# EAGLE schematic Cubesat_Potencia-rev1 (EAGLE 7.2.0)

## Sheet 1 of 11: Conversor 12v
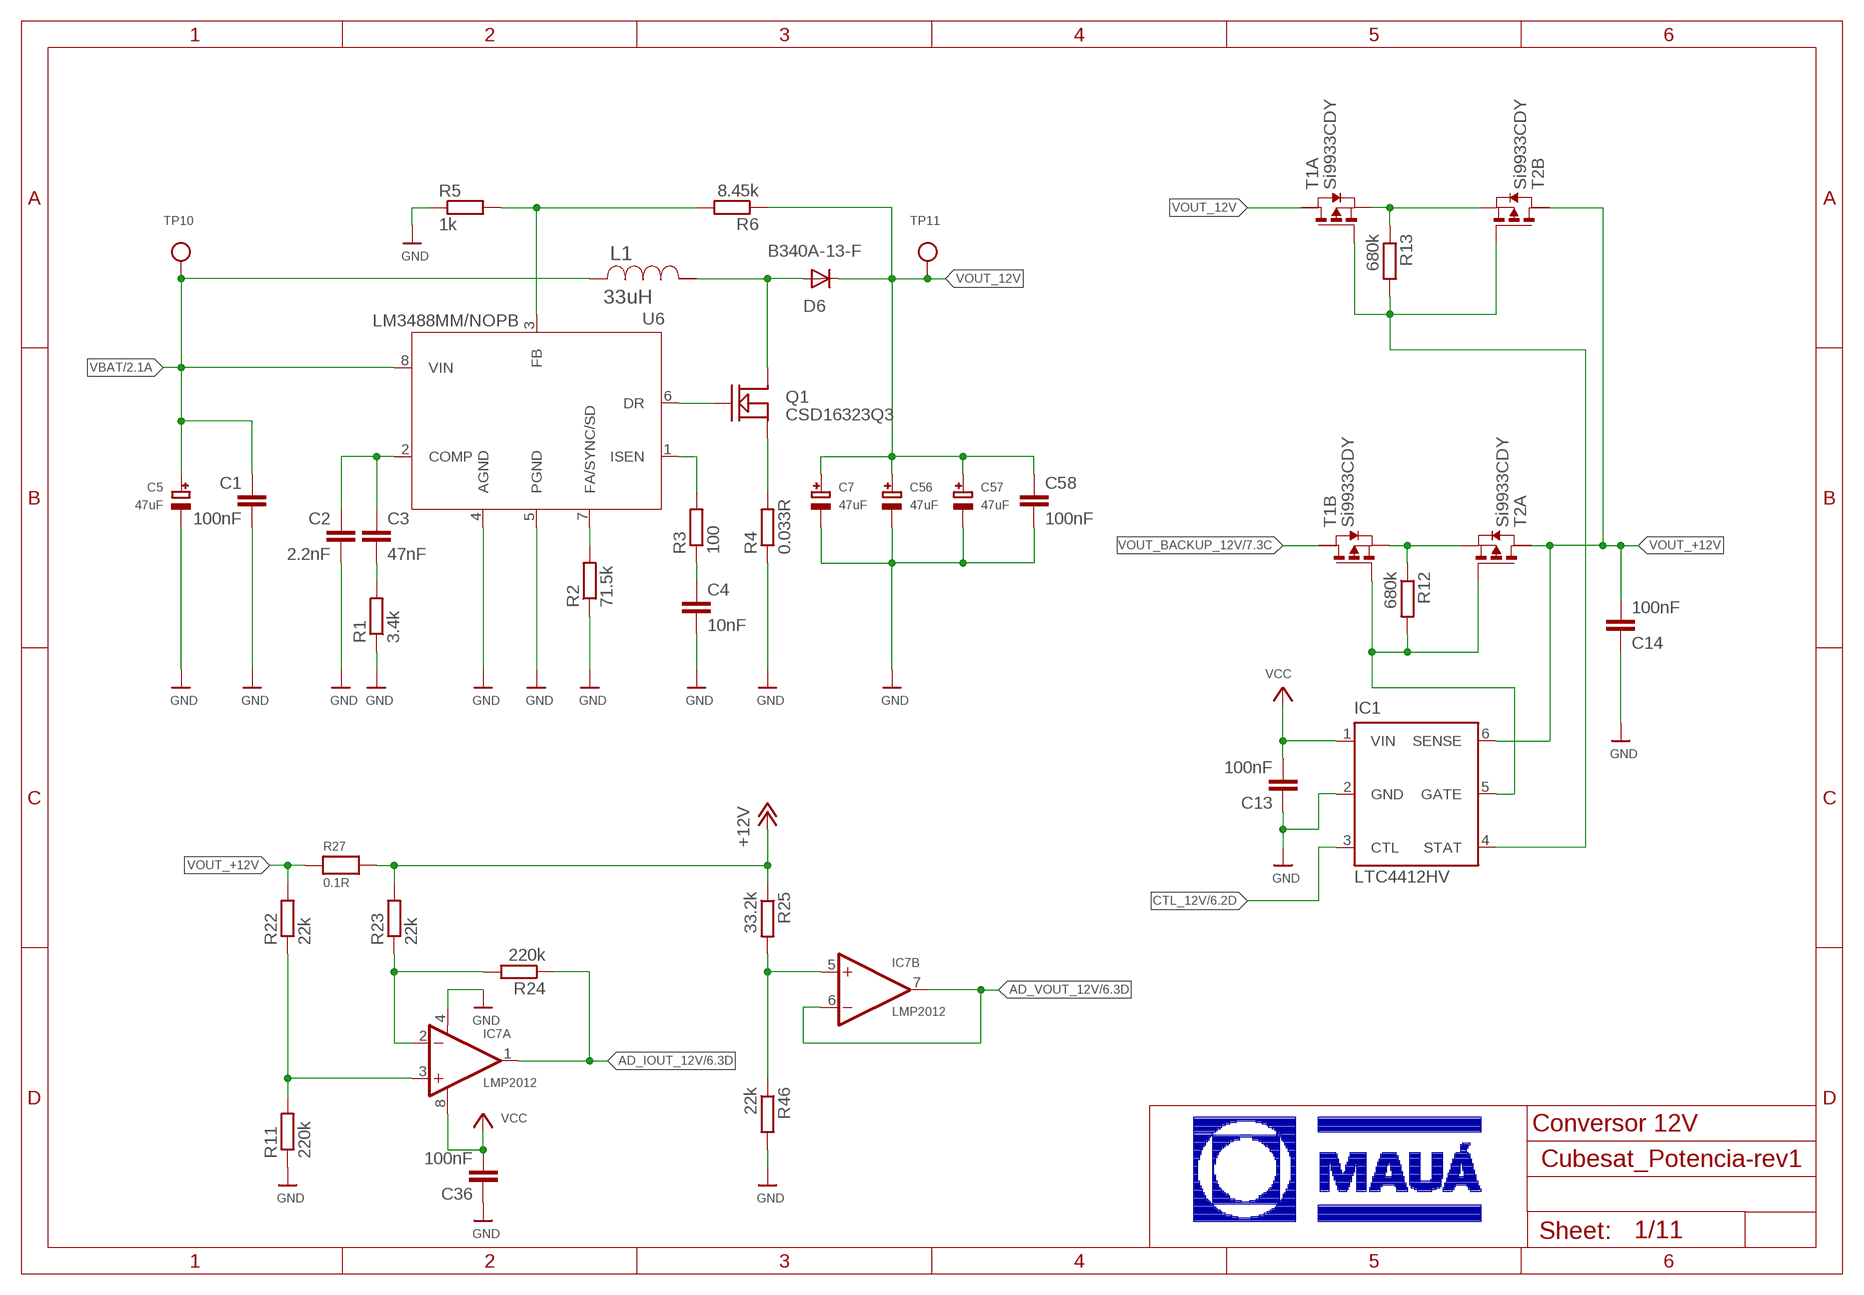
[diagram p0: schematic, sheet 1]

### Parts
C1  100nF  C-EUC0805  [C0805]
C2  2.2nF  C-EUC0805  [C0805]
C3  47nF  C-EUC0805  [C0805]
C4  10nF  C-EUC0805  [C0805]
C5  47uF  CAP_TANTALUMC/6032_REFLOW  [EIA6032-28/C-R]
C7  47uF  CAP_TANTALUMC/6032_REFLOW  [EIA6032-28/C-R]
C13  100nF  C-EUC0805  [C0805]
C14  100nF  C-EUC0805  [C0805]
C36  100nF  C-EUC0805  [C0805]
C56  47uF  CAP_TANTALUMC/6032_REFLOW  [EIA6032-28/C-R]
C57  47uF  CAP_TANTALUMC/6032_REFLOW  [EIA6032-28/C-R]
C58  100nF  C-EUC0805  [C0805]
D6  B340A-13-F  DIODE-DO214AC  [DO214AC]
IC1  LTC4412HV  [TSOT23-6]
IC7  LMP2012  OPA2237E  [MSOP08]
L1  33uH  SDR1307-330KL  [SDR1307]
Q1  CSD16323Q3  [TRANS_NEXFET_Q3]
R1  3.4k  R-EU_M0805  [M0805]
R2  71.5k  R-EU_M0805  [M0805]
R3  100  R-EU_M0805  [M0805]
R4  0.033R  R-EU_M1206  [M1206]
R5  1k  R-EU_M0805  [M0805]
R6  8.45k  R-EU_M0805  [M0805]
R11  220k  R-EU_M0805  [M0805]
R12  680k  R-EU_M0805  [M0805]
R13  680k  R-EU_M0805  [M0805]
R22  22k  R-EU_M0805  [M0805]
R23  22k  R-EU_M0805  [M0805]
R24  220k  R-EU_M0805  [M0805]
R25  33.2k  R-EU_M0805  [M0805]
R27  0.1R  RESISTOR2818  [_2818]
R46  22k  R-EU_M0805  [M0805]
T1  Si9933CDY  PMOS2SO8  [SO8]
T2  Si9933CDY  PMOS2SO8  [SO8]
TP10  TESTPOINT0.1"  [1X01_ROUND]
TP11  TESTPOINT0.1"  [1X01_ROUND]
U6  LM3488MM/NOPB  [MUA08A]

### Nets
6: D6.A L1.2 Q1.5(DRAIN)
+12V: R23.2 R25.1 R27.2 ; also sheet 7
AD_IOUT_12V: IC7.1(A:OUT) R24.1 ; also sheet 6
AD_VOUT_12V: IC7.6(B:-IN) IC7.7(B:OUT) ; also sheet 6
CTL_12V: IC1.3(CTL) ; also sheet 6
GND: C1.2 C2.2 C4.2 C5.- C7.- C13.1 C14.1 C36.1 C56.- C57.- C58.2 IC1.2(GND) IC7.4(A:V-) R1.1 R2.1 R4.1 R5.1 R11.1 R46.2 U6.4(AGND) U6.5(PGND) ; also sheet 2,3,4,5,6,7,8,9,10,11
N$2: Q1.1(SOURCE) R4.2
N$3: Q1.4(GATE) U6.6(DR)
N$4: R2.2 U6.7(FA/SYNC/SD)
N$5: R3.2 U6.1(ISEN)
N$6: C4.1 R3.1
N$7: R5.2 R6.2 U6.3(FB)
N$8: C2.1 C3.1 U6.2(COMP)
N$9: C3.2 R1.2
N$16: R13.1 T1.1(A:S) T2.3(B:S)
N$17: R12.1 T1.3(B:S) T2.1(A:S)
N$23: IC1.5(GATE) R12.2 T1.4(B:G) T2.2(A:G)
N$32: IC7.5(B:+IN) R25.2 R46.1
N$34: IC7.2(A:-IN) R23.1 R24.2
N$35: IC7.3(A:+IN) R11.2 R22.1
STAT_12V: IC1.4(STAT) R13.2 T1.2(A:G) T2.4(B:G)
VBAT: C1.1 C5.+ L1.1 TP10.1 U6.8(VIN) ; also sheet 2,3,4,5,7,8,9
VCC: C13.2 C36.2 IC1.1(VIN) IC7.8(A:V+) ; also sheet 2,3,4,5,6,7,8,10,11
VOUT_12V: C7.+ C56.+ C57.+ C58.1 D6.C R6.1 T1.7(A:D) TP11.1
VOUT_+12V: C14.2 IC1.6(SENSE) R22.2 R27.1 T2.6(B:D) T2.7(A:D)
VOUT_BACKUP_12V: T1.6(B:D) ; also sheet 7,9
Unconnected: T1.5(B:D2) T1.8(A:D2) T2.5(B:D2) T2.8(A:D2)

### Notes on the sheet
- Conversor 12V

## Sheet 2 of 11: Conversor 5v
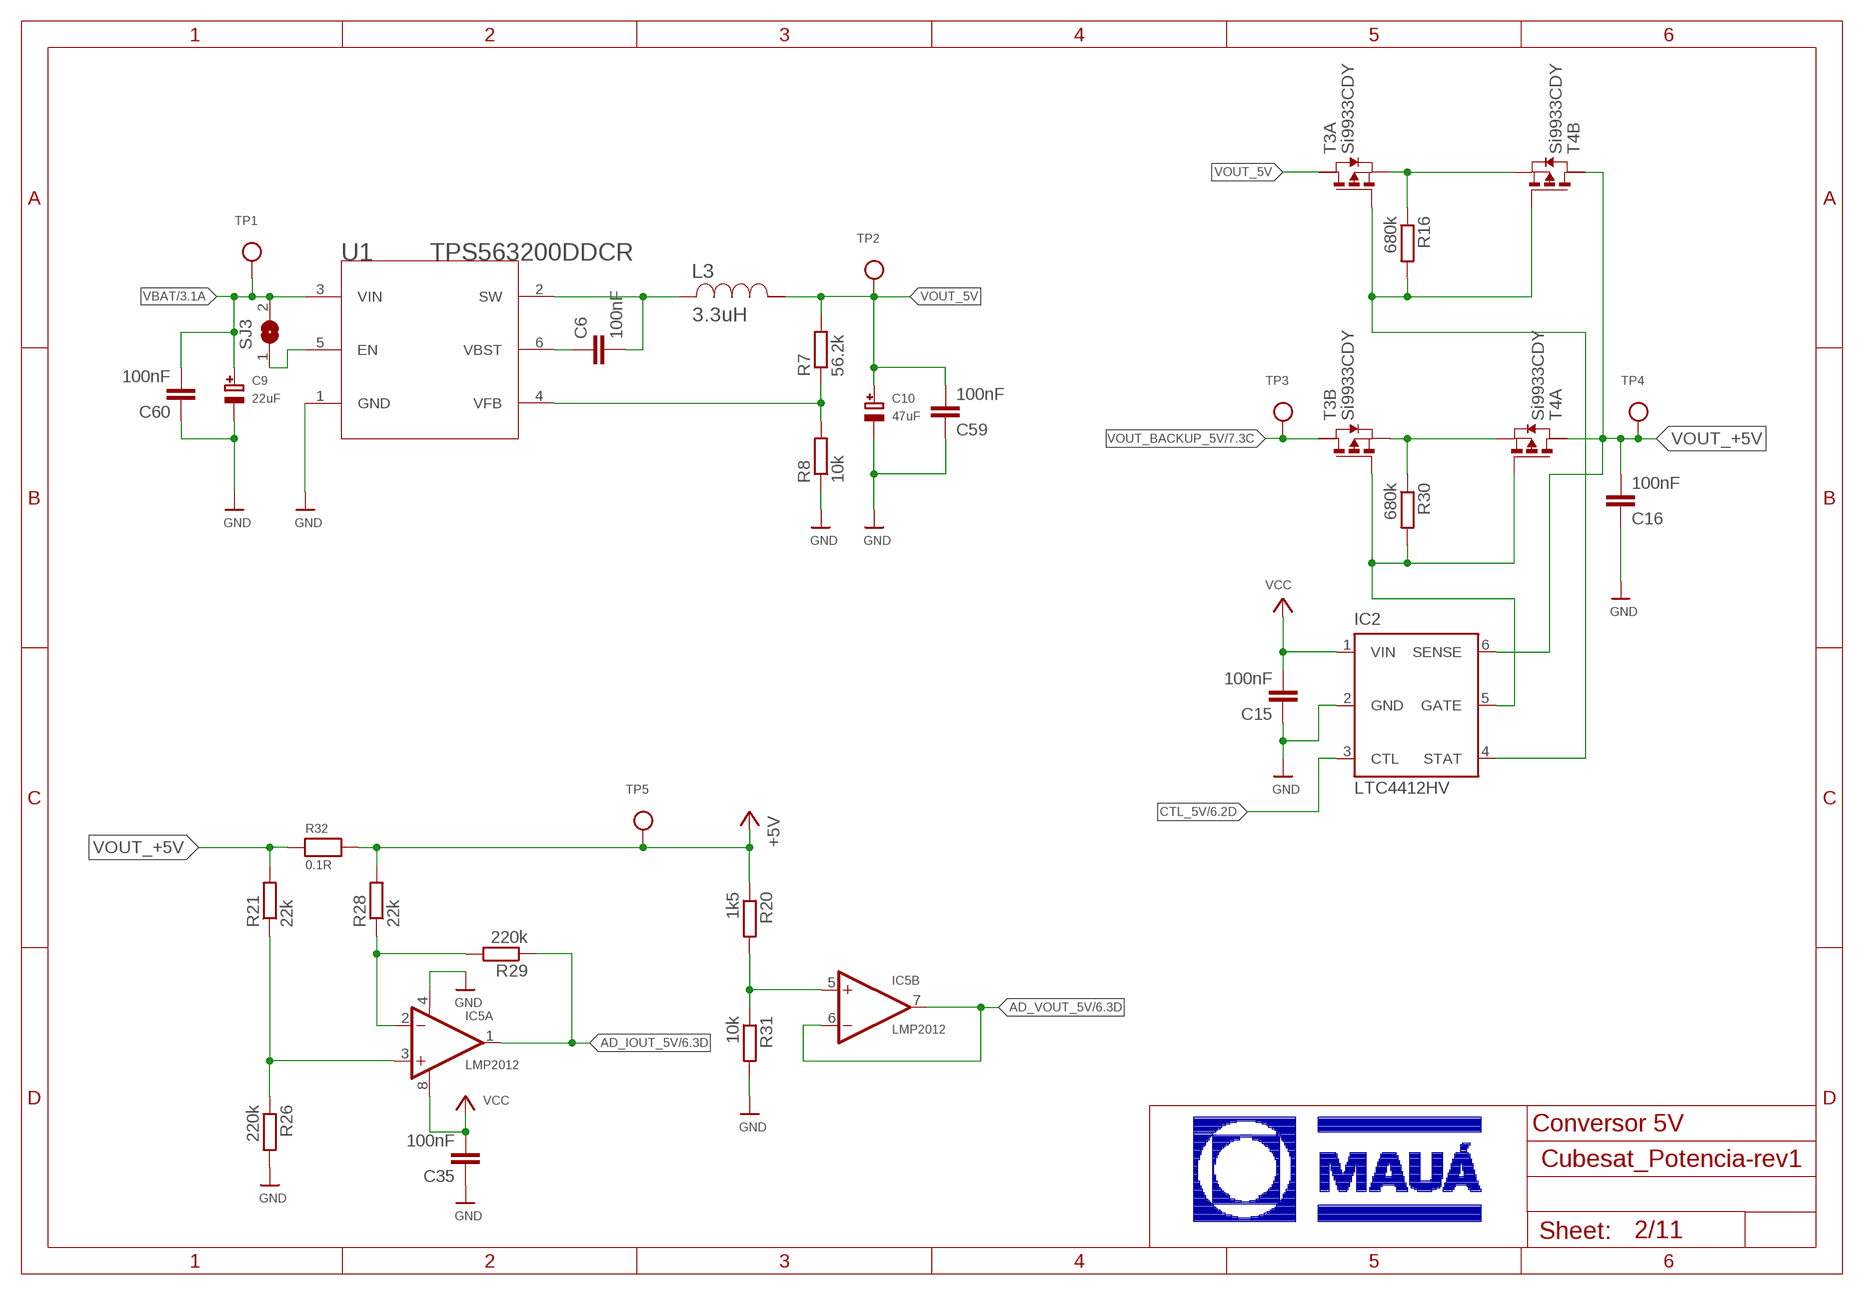
[diagram p1: schematic, sheet 2]

### Parts
C6  100nF  C-EUC0805  [C0805]
C9  22uF  CAP_TANTALUMC/6032_REFLOW  [EIA6032-28/C-R]
C10  47uF  CAP_TANTALUMC/6032_REFLOW  [EIA6032-28/C-R]
C15  100nF  C-EUC0805  [C0805]
C16  100nF  C-EUC0805  [C0805]
C35  100nF  C-EUC0805  [C0805]
C59  100nF  C-EUC0805  [C0805]
C60  100nF  C-EUC0805  [C0805]
IC2  LTC4412HV  [TSOT23-6]
IC5  LMP2012  OPA2237E  [MSOP08]
L3  3.3uH  SRR6038-3R3Y  [SRR6038]
R7  56.2k  R-EU_M0805  [M0805]
R8  10k  R-EU_M0805  [M0805]
R16  680k  R-EU_M0805  [M0805]
R20  1k5  R-EU_M0805  [M0805]
R21  22k  R-EU_M0805  [M0805]
R26  220k  R-EU_M0805  [M0805]
R28  22k  R-EU_M0805  [M0805]
R29  220k  R-EU_M0805  [M0805]
R30  680k  R-EU_M0805  [M0805]
R31  10k  R-EU_M0805  [M0805]
R32  0.1R  RESISTOR2818  [_2818]
SJ3  SOLDERJUMPER  [SOLDERJUMPER_ARROW_NOPASTE]
T3  Si9933CDY  PMOS2SO8  [SO8]
T4  Si9933CDY  PMOS2SO8  [SO8]
TP1  TESTPOINT0.1"  [1X01_ROUND]
TP2  TESTPOINT0.1"  [1X01_ROUND]
TP3  TESTPOINT0.1"  [1X01_ROUND]
TP4  TESTPOINT0.1"  [1X01_ROUND]
TP5  TESTPOINT0.1"  [1X01_ROUND]
U1  TPS563200DDCR  [DDC0006A]

### Nets
+5V: R20.1 R28.2 R32.2 TP5.1 ; also sheet 5,7
AD_IOUT_5V: IC5.1(A:OUT) R29.1 ; also sheet 6
AD_VOUT_5V: IC5.6(B:-IN) IC5.7(B:OUT) ; also sheet 6
CTL_5V: IC2.3(CTL) ; also sheet 6
GND: C9.- C10.- C15.1 C16.1 C35.1 C59.1 C60.1 IC2.2(GND) IC5.4(A:V-) R8.1 R26.2 R31.2 U1.1(GND) ; also sheet 1,3,4,5,6,7,8,9,10,11
N$11: C6.1 U1.6(VBST)
N$12: C6.2 L3.1 U1.2(SW)
N$13: R7.1 R8.2 U1.4(VFB)
N$15: R16.1 T3.1(A:S) T4.3(B:S)
N$18: R30.1 T3.3(B:S) T4.1(A:S)
N$20: IC2.5(GATE) R30.2 T3.4(B:G) T4.2(A:G)
N$31: IC5.5(B:+IN) R20.2 R31.1
N$36: IC5.2(A:-IN) R28.1 R29.2
N$39: IC5.3(A:+IN) R21.1 R26.1
N$71: SJ3.1 U1.5(EN)
STAT_5V: IC2.4(STAT) R16.2 T3.2(A:G) T4.4(B:G)
VBAT: C9.+ C60.2 SJ3.2 TP1.1 U1.3(VIN) ; also sheet 1,3,4,5,7,8,9
VCC: C15.2 C35.2 IC2.1(VIN) IC5.8(A:V+) ; also sheet 1,3,4,5,6,7,8,10,11
VOUT_5V: C10.+ C59.2 L3.2 R7.2 T3.7(A:D) TP2.1
VOUT_+5V: C16.2 IC2.6(SENSE) R21.2 R32.1 T4.6(B:D) T4.7(A:D) TP4.1
VOUT_BACKUP_5V: T3.6(B:D) TP3.1 ; also sheet 7,9
Unconnected: T3.5(B:D2) T3.8(A:D2) T4.5(B:D2) T4.8(A:D2)

### Notes on the sheet
- Conversor 5V

## Sheet 3 of 11: Conversor 3v3
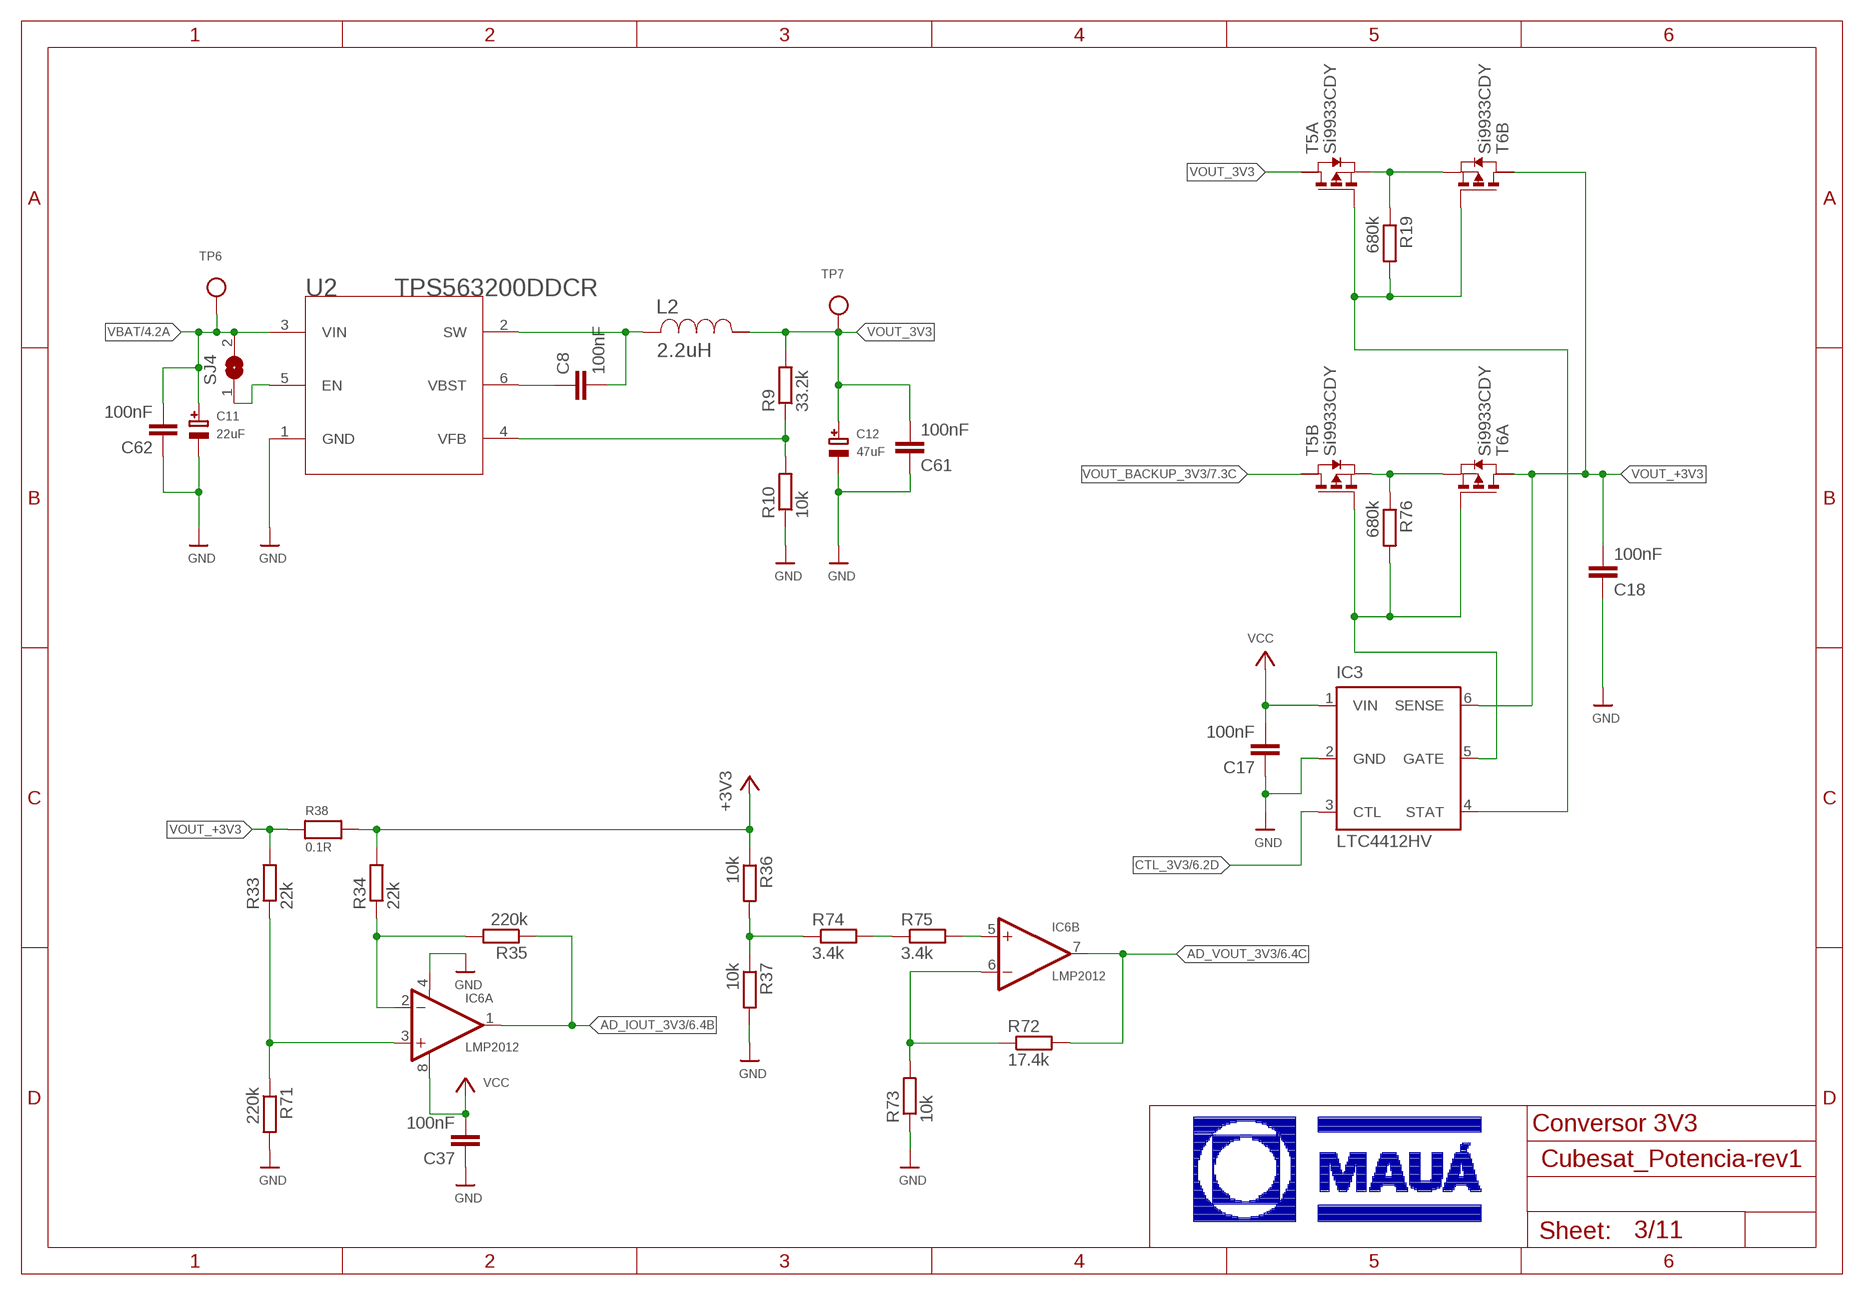
[diagram p2: schematic, sheet 3]

### Parts
C8  100nF  C-EUC0805  [C0805]
C11  22uF  CAP_TANTALUMC/6032_REFLOW  [EIA6032-28/C-R]
C12  47uF  CAP_TANTALUMC/6032_REFLOW  [EIA6032-28/C-R]
C17  100nF  C-EUC0805  [C0805]
C18  100nF  C-EUC0805  [C0805]
C37  100nF  C-EUC0805  [C0805]
C61  100nF  C-EUC0805  [C0805]
C62  100nF  C-EUC0805  [C0805]
IC3  LTC4412HV  [TSOT23-6]
IC6  LMP2012  OPA2237E  [MSOP08]
L2  2.2uH  SRR6038-3R3Y  [SRR6038]
R9  33.2k  R-EU_M0805  [M0805]
R10  10k  R-EU_M0805  [M0805]
R19  680k  R-EU_M0805  [M0805]
R33  22k  R-EU_M0805  [M0805]
R34  22k  R-EU_M0805  [M0805]
R35  220k  R-EU_M0805  [M0805]
R36  10k  R-EU_M0805  [M0805]
R37  10k  R-EU_M0805  [M0805]
R38  0.1R  RESISTOR2818  [_2818]
R71  220k  R-EU_M0805  [M0805]
R72  17.4k  R-EU_M0805  [M0805]
R73  10k  R-EU_M0805  [M0805]
R74  3.4k  R-EU_M0805  [M0805]
R75  3.4k  R-EU_M0805  [M0805]
R76  680k  R-EU_M0805  [M0805]
SJ4  SOLDERJUMPER  [SOLDERJUMPER_ARROW_NOPASTE]
T5  Si9933CDY  PMOS2SO8  [SO8]
T6  Si9933CDY  PMOS2SO8  [SO8]
TP6  TESTPOINT0.1"  [1X01_ROUND]
TP7  TESTPOINT0.1"  [1X01_ROUND]
U2  TPS563200DDCR  [DDC0006A]

### Nets
+3V3: R34.2 R36.1 R38.2 ; also sheet 7
AD_IOUT_3V3: IC6.1(A:OUT) R35.1 ; also sheet 6
AD_VOUT_3V3: IC6.7(B:OUT) R72.2 ; also sheet 6
CTL_3V3: IC3.3(CTL) ; also sheet 6
GND: C11.- C12.- C17.1 C18.1 C37.1 C61.1 C62.1 IC3.2(GND) IC6.4(A:V-) R10.1 R37.2 R71.2 R73.1 U2.1(GND) ; also sheet 1,2,4,5,6,7,8,9,10,11
N$1: C8.1 U2.6(VBST)
N$10: C8.2 L2.1 U2.2(SW)
N$14: R9.1 R10.2 U2.4(VFB)
N$22: IC6.6(B:-IN) R72.1 R73.2
N$24: R74.2 R75.1
N$25: R19.1 T5.1(A:S) T6.3(B:S)
N$26: R76.1 T5.3(B:S) T6.1(A:S)
N$28: IC3.5(GATE) R76.2 T5.4(B:G) T6.2(A:G)
N$37: IC6.5(B:+IN) R75.2
N$40: R36.2 R37.1 R74.1
N$41: IC6.2(A:-IN) R34.1 R35.2
N$42: IC6.3(A:+IN) R33.1 R71.1
N$72: SJ4.1 U2.5(EN)
STAT_3V3: IC3.4(STAT) R19.2 T5.2(A:G) T6.4(B:G)
VBAT: C11.+ C62.2 SJ4.2 TP6.1 U2.3(VIN) ; also sheet 1,2,4,5,7,8,9
VCC: C17.2 C37.2 IC3.1(VIN) IC6.8(A:V+) ; also sheet 1,2,4,5,6,7,8,10,11
VOUT_3V3: C12.+ C61.2 L2.2 R9.2 T5.7(A:D) TP7.1
VOUT_+3V3: C18.2 IC3.6(SENSE) R33.2 R38.1 T6.6(B:D) T6.7(A:D)
VOUT_BACKUP_3V3: T5.6(B:D) ; also sheet 7,9
Unconnected: T5.5(B:D2) T5.8(A:D2) T6.5(B:D2) T6.8(A:D2)

### Notes on the sheet
- Conversor 3V3

## Sheet 4 of 11: Tensão Vnerg
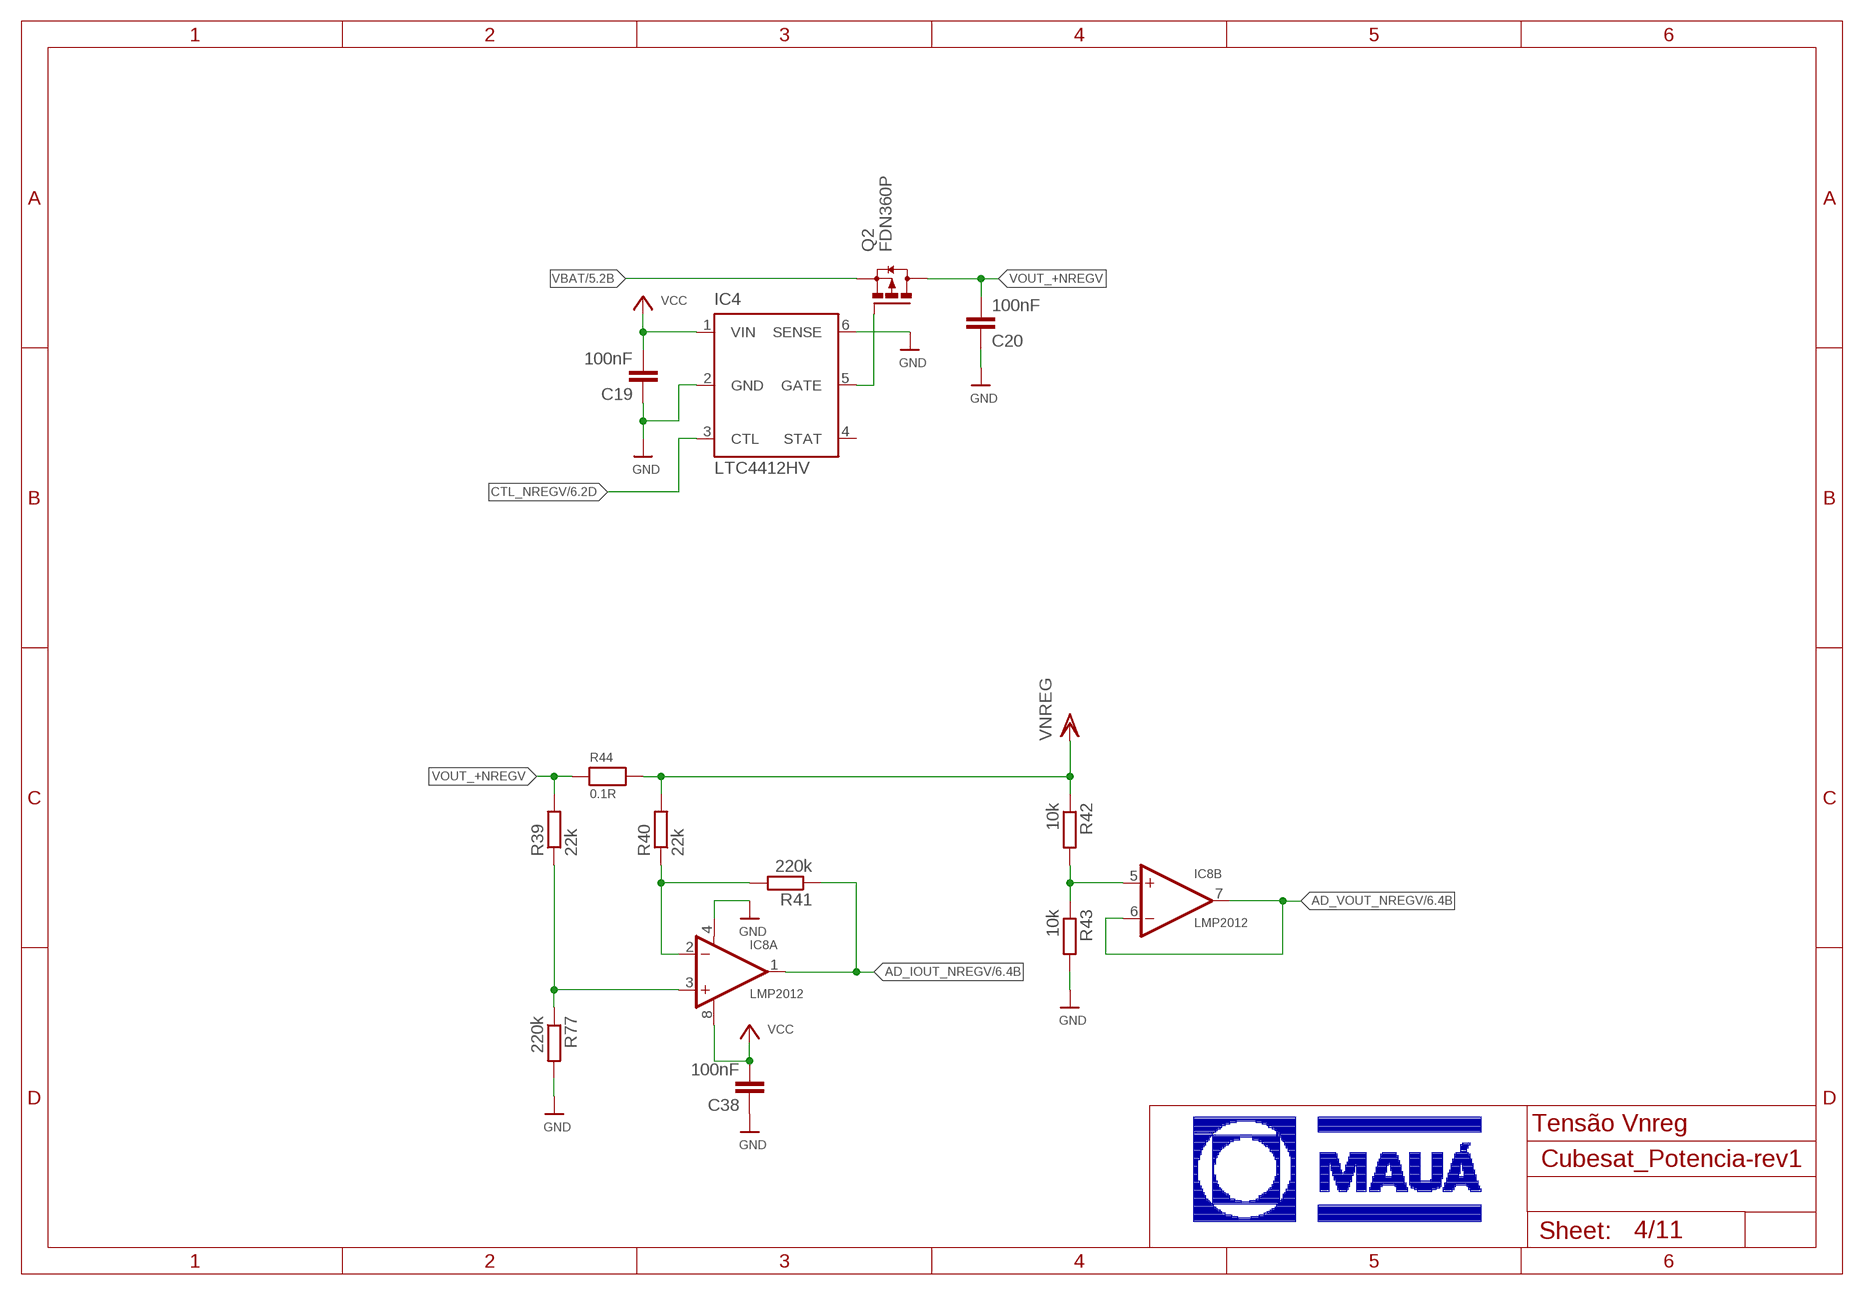
[diagram p3: schematic, sheet 4]

### Parts
C19  100nF  C-EUC0805  [C0805]
C20  100nF  C-EUC0805  [C0805]
C38  100nF  C-EUC0805  [C0805]
IC4  LTC4412HV  [TSOT23-6]
IC8  LMP2012  OPA2237E  [MSOP08]
Q2  FDN360P  [SUPER-SOT3]
R39  22k  R-EU_M0805  [M0805]
R40  22k  R-EU_M0805  [M0805]
R41  220k  R-EU_M0805  [M0805]
R42  10k  R-EU_M0805  [M0805]
R43  10k  R-EU_M0805  [M0805]
R44  0.1R  RESISTOR2818  [_2818]
R77  220k  R-EU_M0805  [M0805]

### Nets
AD_IOUT_NREGV: IC8.1(A:OUT) R41.1 ; also sheet 6
AD_VOUT_NREGV: IC8.6(B:-IN) IC8.7(B:OUT) ; also sheet 6
CTL_NREGV: IC4.3(CTL) ; also sheet 6
GND: C19.1 C20.1 C38.1 IC4.2(GND) IC4.6(SENSE) IC8.4(A:V-) R43.2 R77.2 ; also sheet 1,2,3,5,6,7,8,9,10,11
N$30: IC4.5(GATE) Q2.1(G)
N$43: IC8.5(B:+IN) R42.2 R43.1
N$44: IC8.2(A:-IN) R40.1 R41.2
N$45: IC8.3(A:+IN) R39.1 R77.1
VBAT: Q2.2(S) ; also sheet 1,2,3,5,7,8,9
VCC: C19.2 C38.2 IC4.1(VIN) IC8.8(A:V+) ; also sheet 1,2,3,5,6,7,8,10,11
VNREG: R40.2 R42.1 R44.2 ; also sheet 7
VOUT_+NREGV: C20.2 Q2.3(D) R39.2 R44.1
Unconnected: IC4.4(STAT)

### Notes on the sheet
- Tensão Vnreg

## Sheet 5 of 11: Alimentação PCB Potência
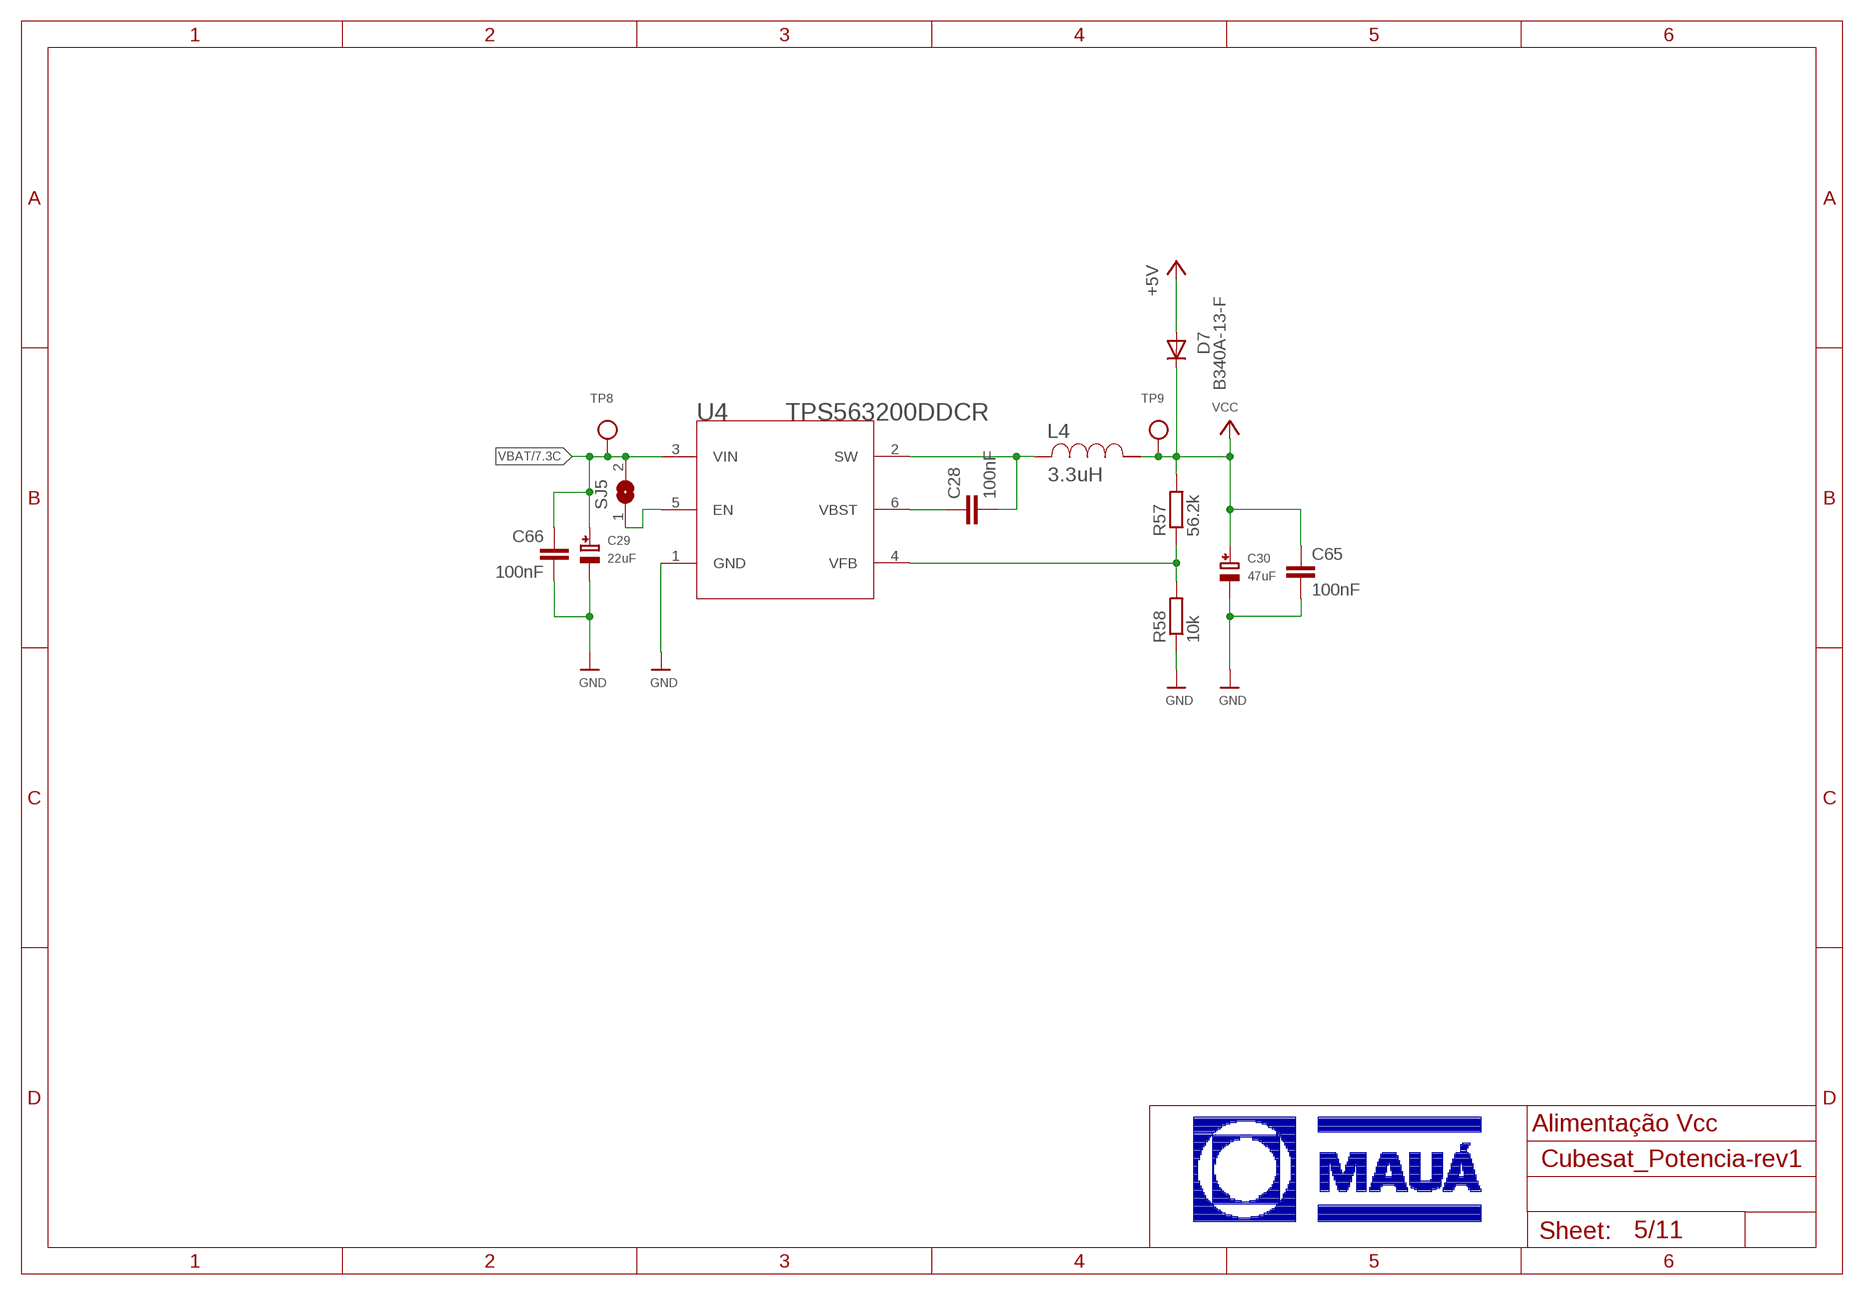
[diagram p4: schematic, sheet 5]

### Parts
C28  100nF  C-EUC0805  [C0805]
C29  22uF  CAP_TANTALUMC/6032_REFLOW  [EIA6032-28/C-R]
C30  47uF  CAP_TANTALUMC/6032_REFLOW  [EIA6032-28/C-R]
C65  100nF  C-EUC0805  [C0805]
C66  100nF  C-EUC0805  [C0805]
D7  B340A-13-F  DIODE-DO214AC  [DO214AC]
L4  3.3uH  SRR6038-3R3Y  [SRR6038]
R57  56.2k  R-EU_M0805  [M0805]
R58  10k  R-EU_M0805  [M0805]
SJ5  SOLDERJUMPER  [SOLDERJUMPER_ARROW_NOPASTE]
TP8  TESTPOINT0.1"  [1X01_ROUND]
TP9  TESTPOINT0.1"  [1X01_ROUND]
U4  TPS563200DDCR  [DDC0006A]

### Nets
+5V: D7.A ; also sheet 2,7
GND: C29.- C30.- C65.2 C66.2 R58.1 U4.1(GND) ; also sheet 1,2,3,4,6,7,8,9,10,11
N$51: C28.1 U4.6(VBST)
N$52: C28.2 L4.1 U4.2(SW)
N$53: R57.1 R58.2 U4.4(VFB)
N$73: SJ5.1 U4.5(EN)
VBAT: C29.+ C66.1 SJ5.2 TP8.1 U4.3(VIN) ; also sheet 1,2,3,4,7,8,9
VCC: C30.+ C65.1 D7.C L4.2 R57.2 TP9.1 ; also sheet 1,2,3,4,6,7,8,10,11

### Notes on the sheet
- Alimentação Vcc

## Sheet 6 of 11: Microcontrolador
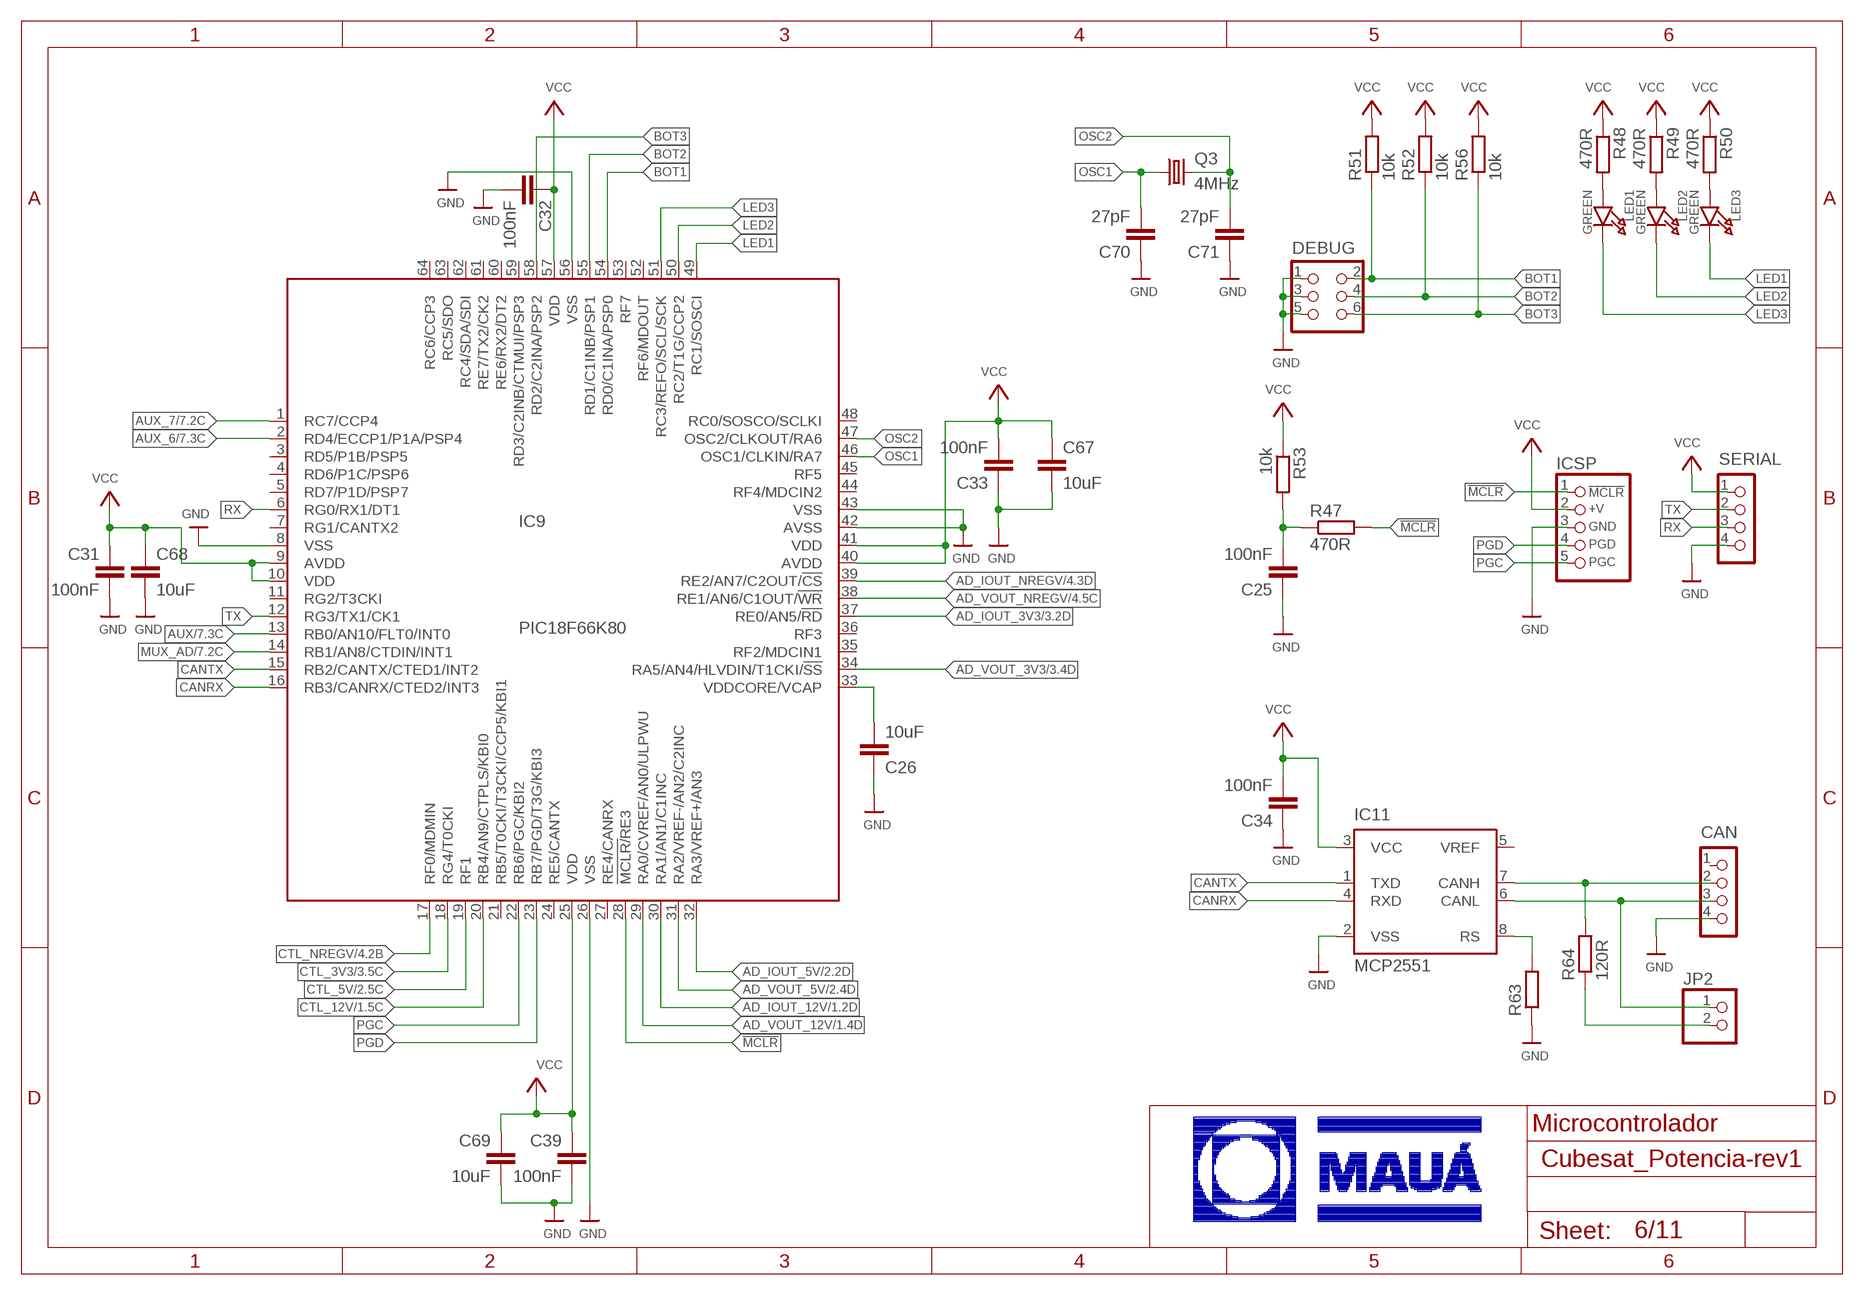
[diagram p5: schematic, sheet 6]

### Parts
C25  100nF  C-EUC0805  [C0805]
C26  10uF  C-EUC0805  [C0805]
C31  100nF  C-EUC0805  [C0805]
C32  100nF  C-EUC0805  [C0805]
C33  100nF  C-EUC0805  [C0805]
C34  100nF  C-EUC0805  [C0805]
C39  100nF  C-EUC0805  [C0805]
C67  10uF  C-EUC0805  [C0805]
C68  10uF  C-EUC0805  [C0805]
C69  10uF  C-EUC0805  [C0805]
C70  27pF  C-EUC0805  [C0805]
C71  27pF  C-EUC0805  [C0805]
CAN  CON_HEADER_1X04  [M1X4]
DEBUG  CON_HEADER_2X03-PTH  [M2X3]
IC9  PIC18F66K80  [TQFP64-10X10X1MM]
IC11  MCP2551  [SO-08]
ICSP  CON_HEADER_PRG_PIC_ICSP0.1INCH_B  [HEADER_PRG_1X05_ICSP_B]
JP2  HEADER-1X2ROUND  [1X02_ROUND]
LED1  GREEN  LED0805  [CHIPLED_0805]
LED2  GREEN  LED0805  [CHIPLED_0805]
LED3  GREEN  LED0805  [CHIPLED_0805]
Q3  4MHz  CRYSTALHC49S  [HC49/S]
R47  470R  R-EU_M0805  [M0805]
R48  470R  R-EU_M0805  [M0805]
R49  470R  R-EU_M0805  [M0805]
R50  470R  R-EU_M0805  [M0805]
R51  10k  R-EU_M0805  [M0805]
R52  10k  R-EU_M0805  [M0805]
R53  10k  R-EU_M0805  [M0805]
R56  10k  R-EU_M0805  [M0805]
R63  R-EU_M0805  [M0805]
R64  120R  R-EU_M0805  [M0805]
SERIAL  CON_HEADER_1X04  [M1X4]

### Nets
!MCLR: IC9.28(!MCLR/!RE3) ICSP.1(/MCLR) R47.2
AD_IOUT_3V3: IC9.37(RE0/AN5/!RD) ; also sheet 3
AD_IOUT_5V: IC9.32(RA3/VREF+/AN3) ; also sheet 2
AD_IOUT_12V: IC9.30(RA1/AN1/C1INC) ; also sheet 1
AD_IOUT_NREGV: IC9.39(RE2/AN7/C2OUT/!CS) ; also sheet 4
AD_VOUT_3V3: IC9.34(RA5/AN4/HLVDIN/T1CKI/!SS) ; also sheet 3
AD_VOUT_5V: IC9.31(RA2/VREF-/AN2/C2INC) ; also sheet 2
AD_VOUT_12V: IC9.29(RA0/CVREF/AN0/ULPWU) ; also sheet 1
AD_VOUT_NREGV: IC9.38(RE1/AN6/C1OUT/!WR) ; also sheet 4
AUX: IC9.13(RB0/AN10/FLT0/INT0) ; also sheet 7,10
AUX_6: IC9.2(RD4/ECCP1/P1A/PSP4) ; also sheet 7,10
AUX_7: IC9.1(RC7/CCP4) ; also sheet 7,10
BOT1: DEBUG.2 IC9.54(RD0/C1INA/PSP0) R51.1
BOT2: DEBUG.4 IC9.55(RD1/C1INB/PSP1) R52.1
BOT3: DEBUG.6 IC9.58(RD2/C2INA/PSP2) R56.1
CANRX: IC9.16(RB3/CANRX/CTED2/INT3) IC11.4(RXD)
CANTX: IC9.15(RB2/CANTX/CTED1/INT2) IC11.1(TXD)
CTL_3V3: IC9.18(RG4/T0CKI) ; also sheet 3
CTL_5V: IC9.19(RF1) ; also sheet 2
CTL_12V: IC9.20(RB4/AN9/CTPLS/KBI0) ; also sheet 1
CTL_NREGV: IC9.17(RF0/MDMIN) ; also sheet 4
GND: C25.1 C26.1 C31.2 C32.2 C33.1 C34.1 C39.2 C67.2 C68.2 C69.2 C70.1 C71.1 CAN.4 DEBUG.1 DEBUG.3 DEBUG.5 IC9.8(VSS) IC9.26(VSS) IC9.42(AVSS) IC9.43(VSS) IC9.56(VSS) IC11.2(VSS) ICSP.3(GND) R63.1 SERIAL.4 ; also sheet 1,2,3,4,5,7,8,9,10,11
LED1: IC9.49(RC1/SOSCI) LED3.C
LED2: IC9.50(RC2/T1G/CCP2) LED2.C
LED3: IC9.51(RC3/REFO/SCL/SCK) LED1.C
MUX_AD: IC9.14(RB1/AN8/CTDIN/INT1) ; also sheet 7,10
N$47: LED1.A R48.2
N$49: LED2.A R49.2
N$50: LED3.A R50.2
N$58: C25.2 R47.1 R53.2
N$60: C26.2 IC9.33(VDDCORE/VCAP)
N$61: JP2.2 R64.1
N$64: CAN.2 IC11.7(CANH) R64.2
N$65: CAN.3 IC11.6(CANL) JP2.1
N$66: IC11.8(RS) R63.2
OSC1: C70.2 IC9.46(OSC1/CLKIN/RA7) Q3.1
OSC2: C71.2 IC9.47(OSC2/CLKOUT/RA6) Q3.2
PGC: IC9.22(RB6/PGC/KBI2) ICSP.5(PGC)
PGD: IC9.23(RB7/PGD/T3G/KBI3) ICSP.4(PGD)
RX: IC9.6(RG0/RX1/DT1) SERIAL.3
TX: IC9.12(RG3/TX1/CK1) SERIAL.2
VCC: C31.1 C32.1 C33.2 C34.2 C39.1 C67.1 C68.1 C69.1 IC9.9(AVDD) IC9.10(VDD) IC9.25(VDD) IC9.40(AVDD) IC9.41(VDD) IC9.57(VDD) IC11.3(VCC) ICSP.2(+V) R48.1 R49.1 R50.1 R51.2 R52.2 R53.1 R56.2 SERIAL.1 ; also sheet 1,2,3,4,5,7,8,10,11
Unconnected: CAN.1 IC9.3(RD5/P1B/PSP5) IC9.4(RD6/P1C/PSP6) IC9.5(RD7/P1D/PSP7) IC9.7(RG1/CANTX2) IC9.11(RG2/T3CKI) IC9.21(RB5/T0CKI/T3CKI/CCP5/KBI1) IC9.24(RE5/CANTX) IC9.27(RE4/CANRX) IC9.35(RF2/MDCIN1) IC9.36(RF3) IC9.44(RF4/MDCIN2) IC9.45(RF5) IC9.48(RC0/SOSCO/SCLKI) IC9.52(RF6/MDOUT) IC9.53(RF7) IC9.59(RD3/C2INB/CTMUI/PSP3) IC9.60(RE6/RX2/DT2) IC9.61(RE7/TX2/CK2) IC9.62(RC4/SDA/SDI) IC9.63(RC5/SDO) IC9.64(RC6/CCP3) IC11.5(VREF)

### Notes on the sheet
- Microcontrolador

## Sheet 7 of 11: Barramento
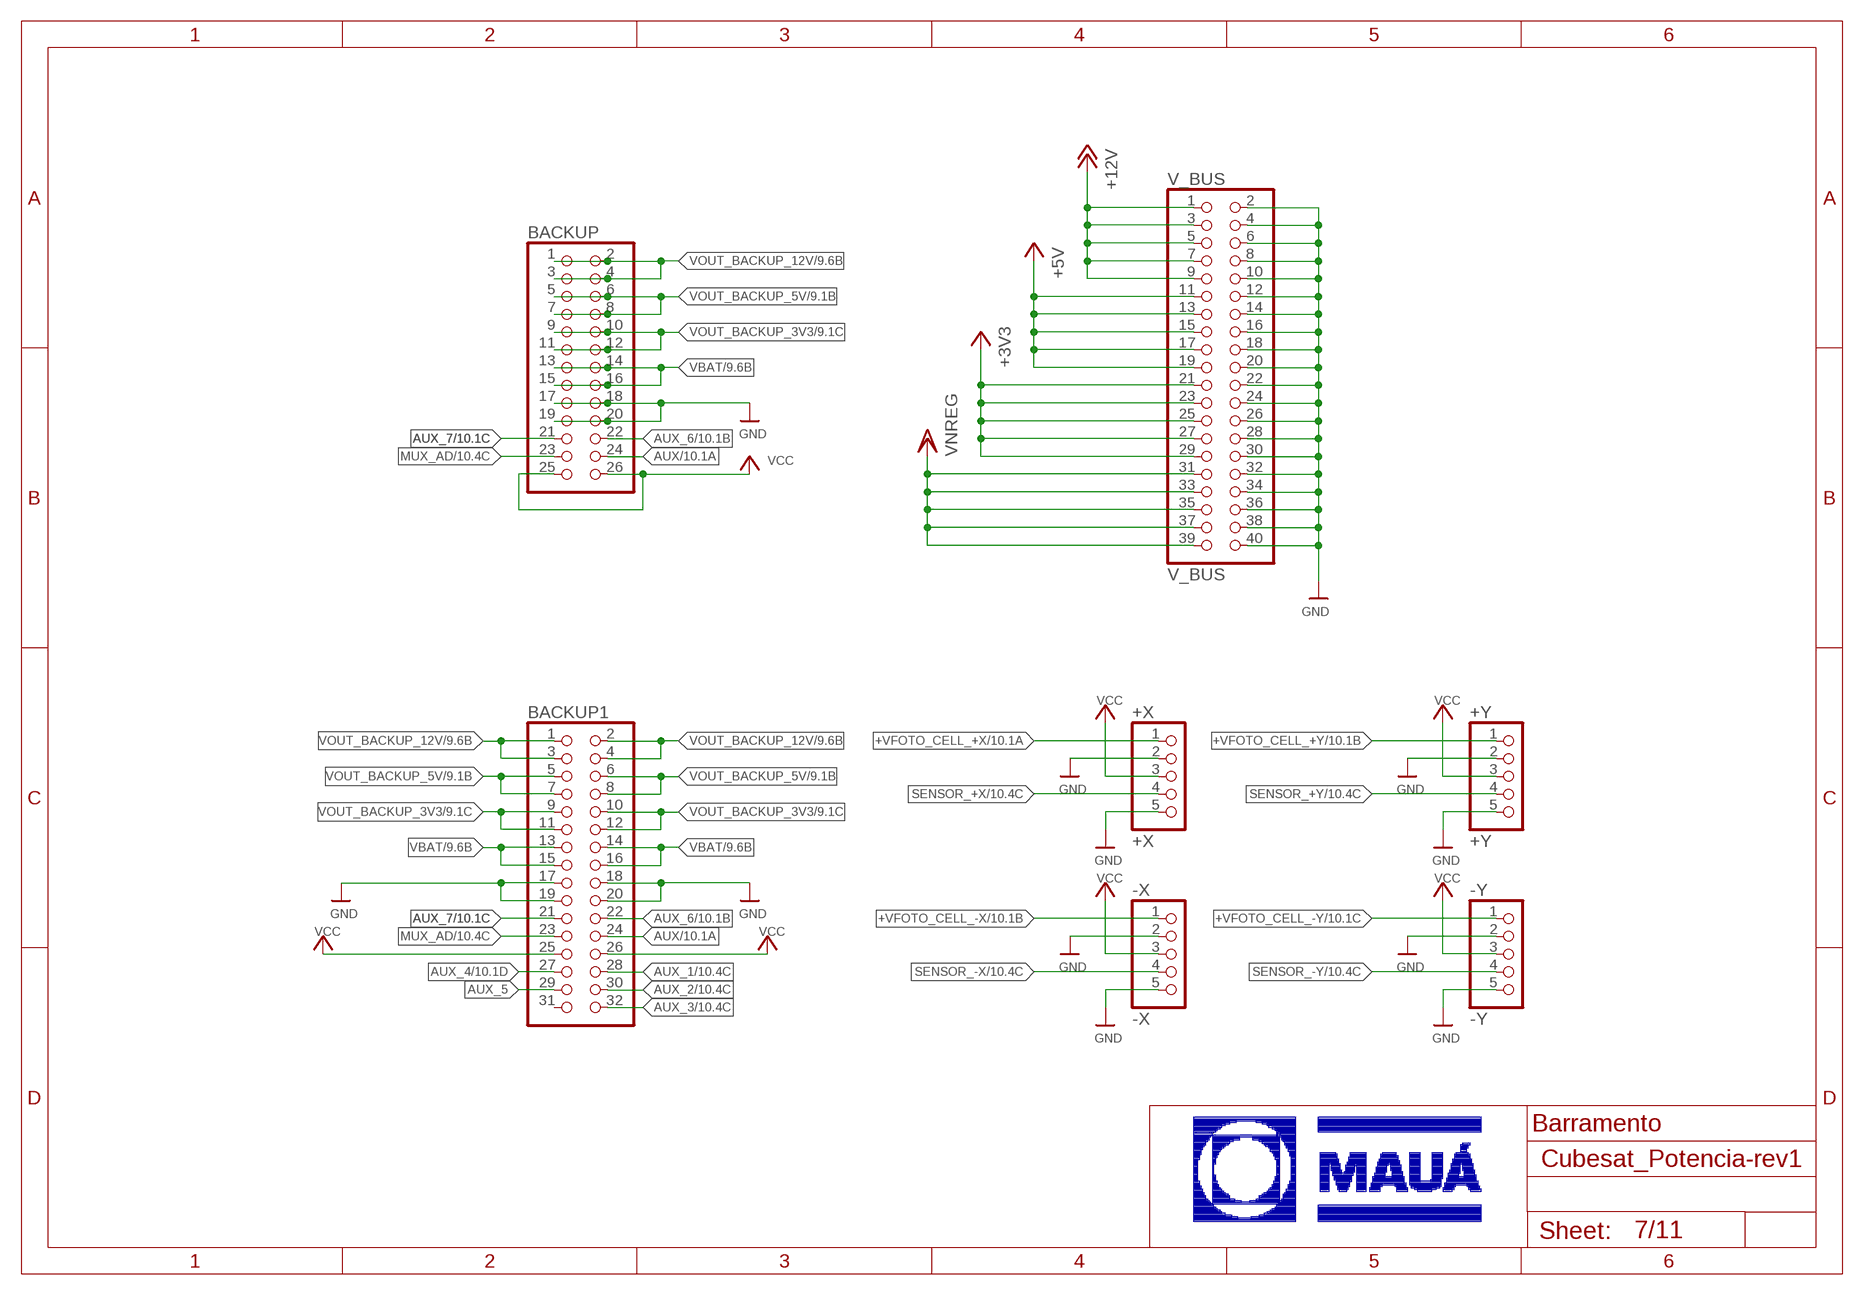
[diagram p6: schematic, sheet 7]

### Parts
+X  +X  PINHD-1X5  [1X05]
+Y  +Y  PINHD-1X5  [1X05]
-X  -X  PINHD-1X5  [1X05]
-Y  -Y  PINHD-1X5  [1X05]
BACKUP  HEADER-2X13  [2X13]
BACKUP1  PINHD-2X16  [2X16]
V_BUS  V_BUS  PINHD-2X20  [2X20]

### Nets
+3V3: V_BUS.21 V_BUS.23 V_BUS.25 V_BUS.27 V_BUS.29 ; also sheet 3
+5V: V_BUS.11 V_BUS.13 V_BUS.15 V_BUS.17 V_BUS.19 ; also sheet 2,5
+12V: V_BUS.1 V_BUS.3 V_BUS.5 V_BUS.7 V_BUS.9 ; also sheet 1
+VFOTO_CELL_+X: +X.1 ; also sheet 10
+VFOTO_CELL_+Y: +Y.1 ; also sheet 10
+VFOTO_CELL_-X: -X.1 ; also sheet 10
+VFOTO_CELL_-Y: -Y.1 ; also sheet 10
AUX: BACKUP1.24 BACKUP.24 ; also sheet 6,10
AUX_1: BACKUP1.28 ; also sheet 10
AUX_2: BACKUP1.30 ; also sheet 10
AUX_3: BACKUP1.32 ; also sheet 10
AUX_4: BACKUP1.27 ; also sheet 10
AUX_5: BACKUP1.29
AUX_6: BACKUP1.22 BACKUP.22 ; also sheet 6,10
AUX_7: BACKUP1.21 BACKUP.21 ; also sheet 6,10
GND: +X.2 +X.5 +Y.2 +Y.5 -X.2 -X.5 -Y.2 -Y.5 BACKUP1.17 BACKUP1.18 BACKUP1.19 BACKUP1.20 BACKUP.17 BACKUP.18 BACKUP.19 BACKUP.20 V_BUS.2 V_BUS.4 V_BUS.6 V_BUS.8 V_BUS.10 V_BUS.12 V_BUS.14 V_BUS.16 V_BUS.18 V_BUS.20 V_BUS.22 V_BUS.24 V_BUS.26 V_BUS.28 V_BUS.30 V_BUS.32 V_BUS.34 V_BUS.36 V_BUS.38 V_BUS.40 ; also sheet 1,2,3,4,5,6,8,9,10,11
MUX_AD: BACKUP1.23 BACKUP.23 ; also sheet 6,10
SENSOR_+X: +X.4 ; also sheet 10
SENSOR_+Y: +Y.4 ; also sheet 10
SENSOR_-X: -X.4 ; also sheet 10
SENSOR_-Y: -Y.4 ; also sheet 10
VBAT: BACKUP1.13 BACKUP1.14 BACKUP1.15 BACKUP1.16 BACKUP.13 BACKUP.14 BACKUP.15 BACKUP.16 ; also sheet 1,2,3,4,5,8,9
VCC: +X.3 +Y.3 -X.3 -Y.3 BACKUP1.25 BACKUP1.26 BACKUP.25 BACKUP.26 ; also sheet 1,2,3,4,5,6,8,10,11
VNREG: V_BUS.31 V_BUS.33 V_BUS.35 V_BUS.37 V_BUS.39 ; also sheet 4
VOUT_BACKUP_3V3: BACKUP1.9 BACKUP1.10 BACKUP1.11 BACKUP1.12 BACKUP.9 BACKUP.10 BACKUP.11 BACKUP.12 ; also sheet 3,9
VOUT_BACKUP_5V: BACKUP1.5 BACKUP1.6 BACKUP1.7 BACKUP1.8 BACKUP.5 BACKUP.6 BACKUP.7 BACKUP.8 ; also sheet 2,9
VOUT_BACKUP_12V: BACKUP1.1 BACKUP1.2 BACKUP1.3 BACKUP1.4 BACKUP.1 BACKUP.2 BACKUP.3 BACKUP.4 ; also sheet 1,9
Unconnected: BACKUP1.31

### Notes on the sheet
- Barramento

## Sheet 8 of 11: Carregador de Bateria
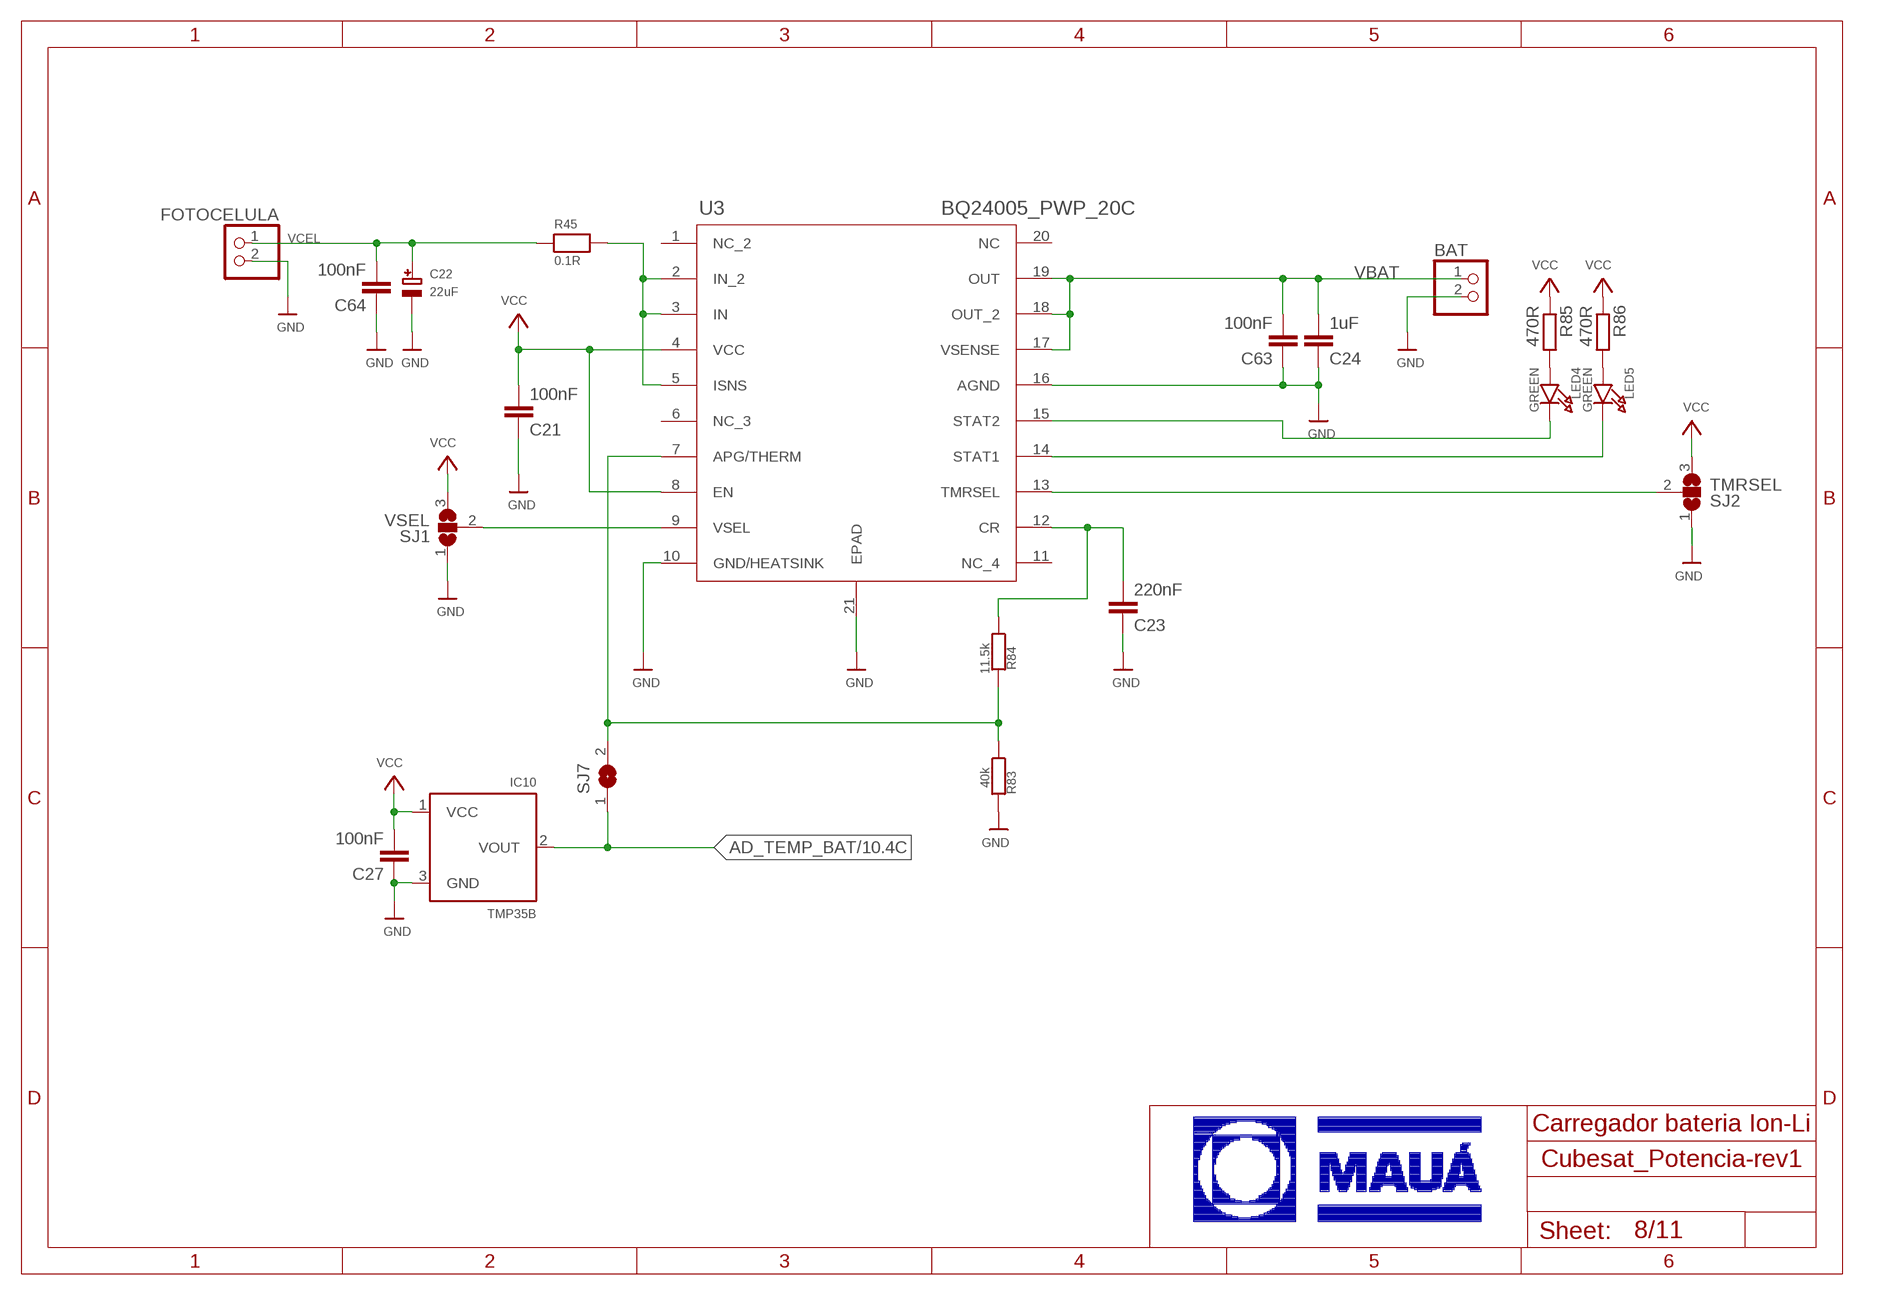
[diagram p7: schematic, sheet 8]

### Parts
BAT  HEADER-1X2  [1X02_OVAL]
C21  100nF  C-EUC0805  [C0805]
C22  22uF  CAP_TANTALUMC/6032_REFLOW  [EIA6032-28/C-R]
C23  220nF  C-EUC0805  [C0805]
C24  1uF  C-EUC0805  [C0805]
C27  100nF  C-EUC0805  [C0805]
C63  100nF  C-EUC0805  [C0805]
C64  100nF  C-EUC0805  [C0805]
FOTOCELULA  HEADER-1X2  [1X02_OVAL]
IC10  TMP35B  [TO92-LINE]
LED4  GREEN  LED0805  [CHIPLED_0805]
LED5  GREEN  LED0805  [CHIPLED_0805]
R45  0.1R  RESISTOR2818  [_2818]
R83  40k  R-EU_M0805  [M0805]
R84  11.5k  R-EU_M0805  [M0805]
R85  470R  R-EU_M0805  [M0805]
R86  470R  R-EU_M0805  [M0805]
SJ1  VSEL  SJ2W  [SJ_2]
SJ2  TMRSEL  SJ2W  [SJ_2]
SJ7  SOLDERJUMPER  [SOLDERJUMPER_ARROW_NOPASTE]
U3  BQ24005_PWP_20C  [PWP20_2P4X3P4-M]

### Nets
AD_TEMP_BAT: IC10.2(VOUT) SJ7.1 ; also sheet 10
GND: BAT.2 C21.1 C22.- C23.1 C24.1 C27.1 C63.1 C64.1 FOTOCELULA.2 IC10.3(GND) R83.2 SJ1.1 SJ2.1 U3.10(GND/HEATSINK) U3.16(AGND) U3.21(EPAD) ; also sheet 1,2,3,4,5,6,7,9,10,11
N$33: R45.2 U3.2(IN_2) U3.3(IN) U3.5(ISNS)
N$38: SJ2.2 U3.13(TMRSEL)
N$46: SJ1.2 U3.9(VSEL)
N$48: C23.2 R84.1 U3.12(CR)
N$80: LED4.A R85.2
N$84: R83.1 R84.2 SJ7.2 U3.7(APG/THERM)
N$86: LED5.A R86.2
N$87: LED5.C U3.14(STAT1)
N$88: LED4.C U3.15(STAT2)
VBAT: BAT.1 C24.2 C63.2 U3.17(VSENSE) U3.18(OUT_2) U3.19(OUT) ; also sheet 1,2,3,4,5,7,9
VCC: C21.2 C27.2 IC10.1(VCC) R85.1 R86.1 SJ1.3 SJ2.3 U3.4(VCC) U3.8(EN) ; also sheet 1,2,3,4,5,6,7,10,11
VCEL: C22.+ C64.2 FOTOCELULA.1 R45.1 ; also sheet 10
Unconnected: U3.1(NC_2) U3.6(NC_3) U3.11(NC_4) U3.20(NC)

### Notes on the sheet
- Carregador bateria Ion-Li

## Sheet 9 of 11: Conversor BACKUP
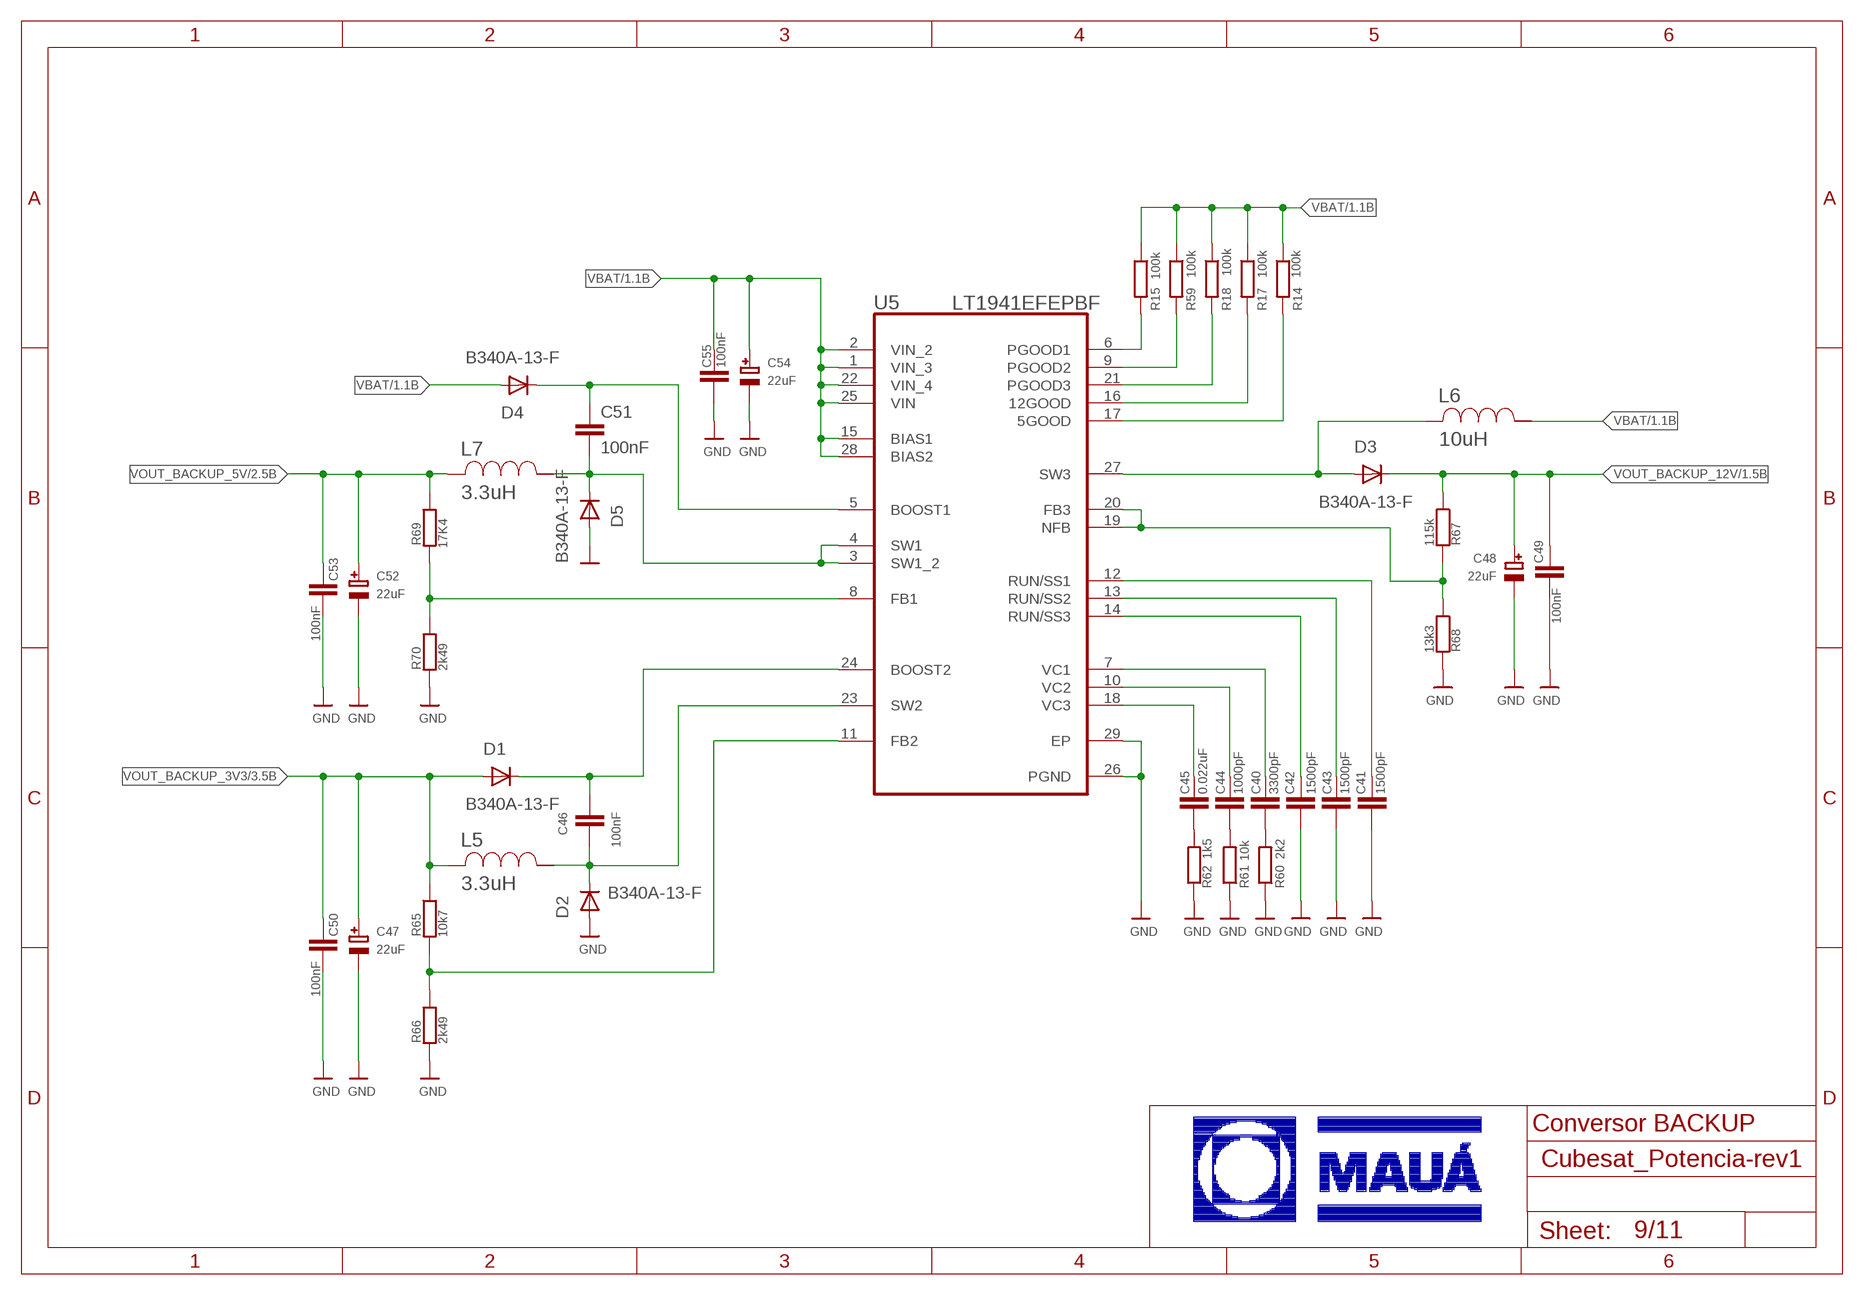
[diagram p8: schematic, sheet 9]

### Parts
C40  3300pF  C-EUC0805  [C0805]
C41  1500pF  C-EUC0805  [C0805]
C42  1500pF  C-EUC0805  [C0805]
C43  1500pF  C-EUC0805  [C0805]
C44  1000pF  C-EUC0805  [C0805]
C45  0.022uF  C-EUC0805  [C0805]
C46  100nF  C-EUC0805  [C0805]
C47  22uF  CAP_TANTALUMC/6032_REFLOW  [EIA6032-28/C-R]
C48  22uF  CAP_TANTALUMC/6032_REFLOW  [EIA6032-28/C-R]
C49  100nF  C-EUC0805  [C0805]
C50  100nF  C-EUC0805  [C0805]
C51  100nF  C-EUC1210  [C1210]
C52  22uF  CAP_TANTALUMC/6032_REFLOW  [EIA6032-28/C-R]
C53  100nF  C-EUC0805  [C0805]
C54  22uF  CAP_TANTALUMC/6032_REFLOW  [EIA6032-28/C-R]
C55  100nF  C-EUC0805  [C0805]
D1  B340A-13-F  DIODE-DO214AC  [DO214AC]
D2  B340A-13-F  DIODE-DO214AC  [DO214AC]
D3  B340A-13-F  DIODE-DO214AC  [DO214AC]
D4  B340A-13-F  DIODE-DO214AC  [DO214AC]
D5  B340A-13-F  DIODE-DO214AC  [DO214AC]
L5  3.3uH  SRR6038-3R3Y  [SRR6038]
L6  10uH  SRR6038-3R3Y  [SRR6038]
L7  3.3uH  SRR6038-3R3Y  [SRR6038]
R14  100k  R-EU_M0805  [M0805]
R15  100k  R-EU_M0805  [M0805]
R17  100k  R-EU_M0805  [M0805]
R18  100k  R-EU_M0805  [M0805]
R59  100k  R-EU_M0805  [M0805]
R60  2k2  R-EU_M0805  [M0805]
R61  10k  R-EU_M0805  [M0805]
R62  1k5  R-EU_M0805  [M0805]
R65  10k7  R-EU_M0805  [M0805]
R66  2k49  R-EU_M0805  [M0805]
R67  115k  R-EU_M0805  [M0805]
R68  13k3  R-EU_M0805  [M0805]
R69  17K4  R-EU_M0805  [M0805]
R70  2k49  R-EU_M0805  [M0805]
U5  LT1941EFEPBF  [SOP65P640X120-29N]

### Nets
BOOST1: C51.1 D4.C U5.5(BOOST1)
FB1: R69.2 R70.1 U5.8(FB1)
FB2: R65.2 R66.1 U5.11(FB2)
FB3: R67.2 R68.1 U5.19(NFB) U5.20(FB3)
GND: C41.2 C42.2 C43.2 C47.- C48.- C49.2 C50.2 C52.- C53.2 C54.- C55.2 D2.A D5.A R60.1 R61.1 R62.1 R66.2 R68.2 R70.2 U5.26(PGND) U5.29(EP) ; also sheet 1,2,3,4,5,6,7,8,10,11
N$19: R14.2 U5.17(5GOOD)
N$21: R17.2 U5.16(12GOOD)
N$27: R18.2 U5.21(PGOOD3)
N$29: R59.2 U5.9(PGOOD2)
N$54: R15.2 U5.6(PGOOD1)
N$55: C41.1 U5.12(RUN/SS1)
N$56: C43.1 U5.13(RUN/SS2)
N$57: C42.1 U5.14(RUN/SS3)
N$59: C40.1 R60.2
N$62: C44.2 U5.10(VC2)
N$63: C45.2 U5.18(VC3)
N$67: C44.1 R61.2
N$68: C45.1 R62.2
N$69: C40.2 U5.7(VC1)
N$70: C46.1 D1.C U5.24(BOOST2)
SW1: C51.2 D5.C L7.2 U5.3(SW1_2) U5.4(SW1)
SW2: C46.2 D2.C L5.2 U5.23(SW2)
SW3: D3.A L6.1 U5.27(SW3)
VBAT: C54.+ C55.1 D4.A L6.2 R14.1 R15.1 R17.1 R18.1 R59.1 U5.1(VIN_3) U5.2(VIN_2) U5.15(BIAS1) U5.22(VIN_4) U5.25(VIN) U5.28(BIAS2) ; also sheet 1,2,3,4,5,7,8
VOUT_BACKUP_3V3: C47.+ C50.1 D1.A L5.1 R65.1 ; also sheet 3,7
VOUT_BACKUP_5V: C52.+ C53.1 L7.1 R69.1 ; also sheet 2,7
VOUT_BACKUP_12V: C48.+ C49.1 D3.C R67.1 ; also sheet 1,7

### Notes on the sheet
- Conversor BACKUP

## Sheet 10 of 11: Controle Painel Solar+ Mux AD
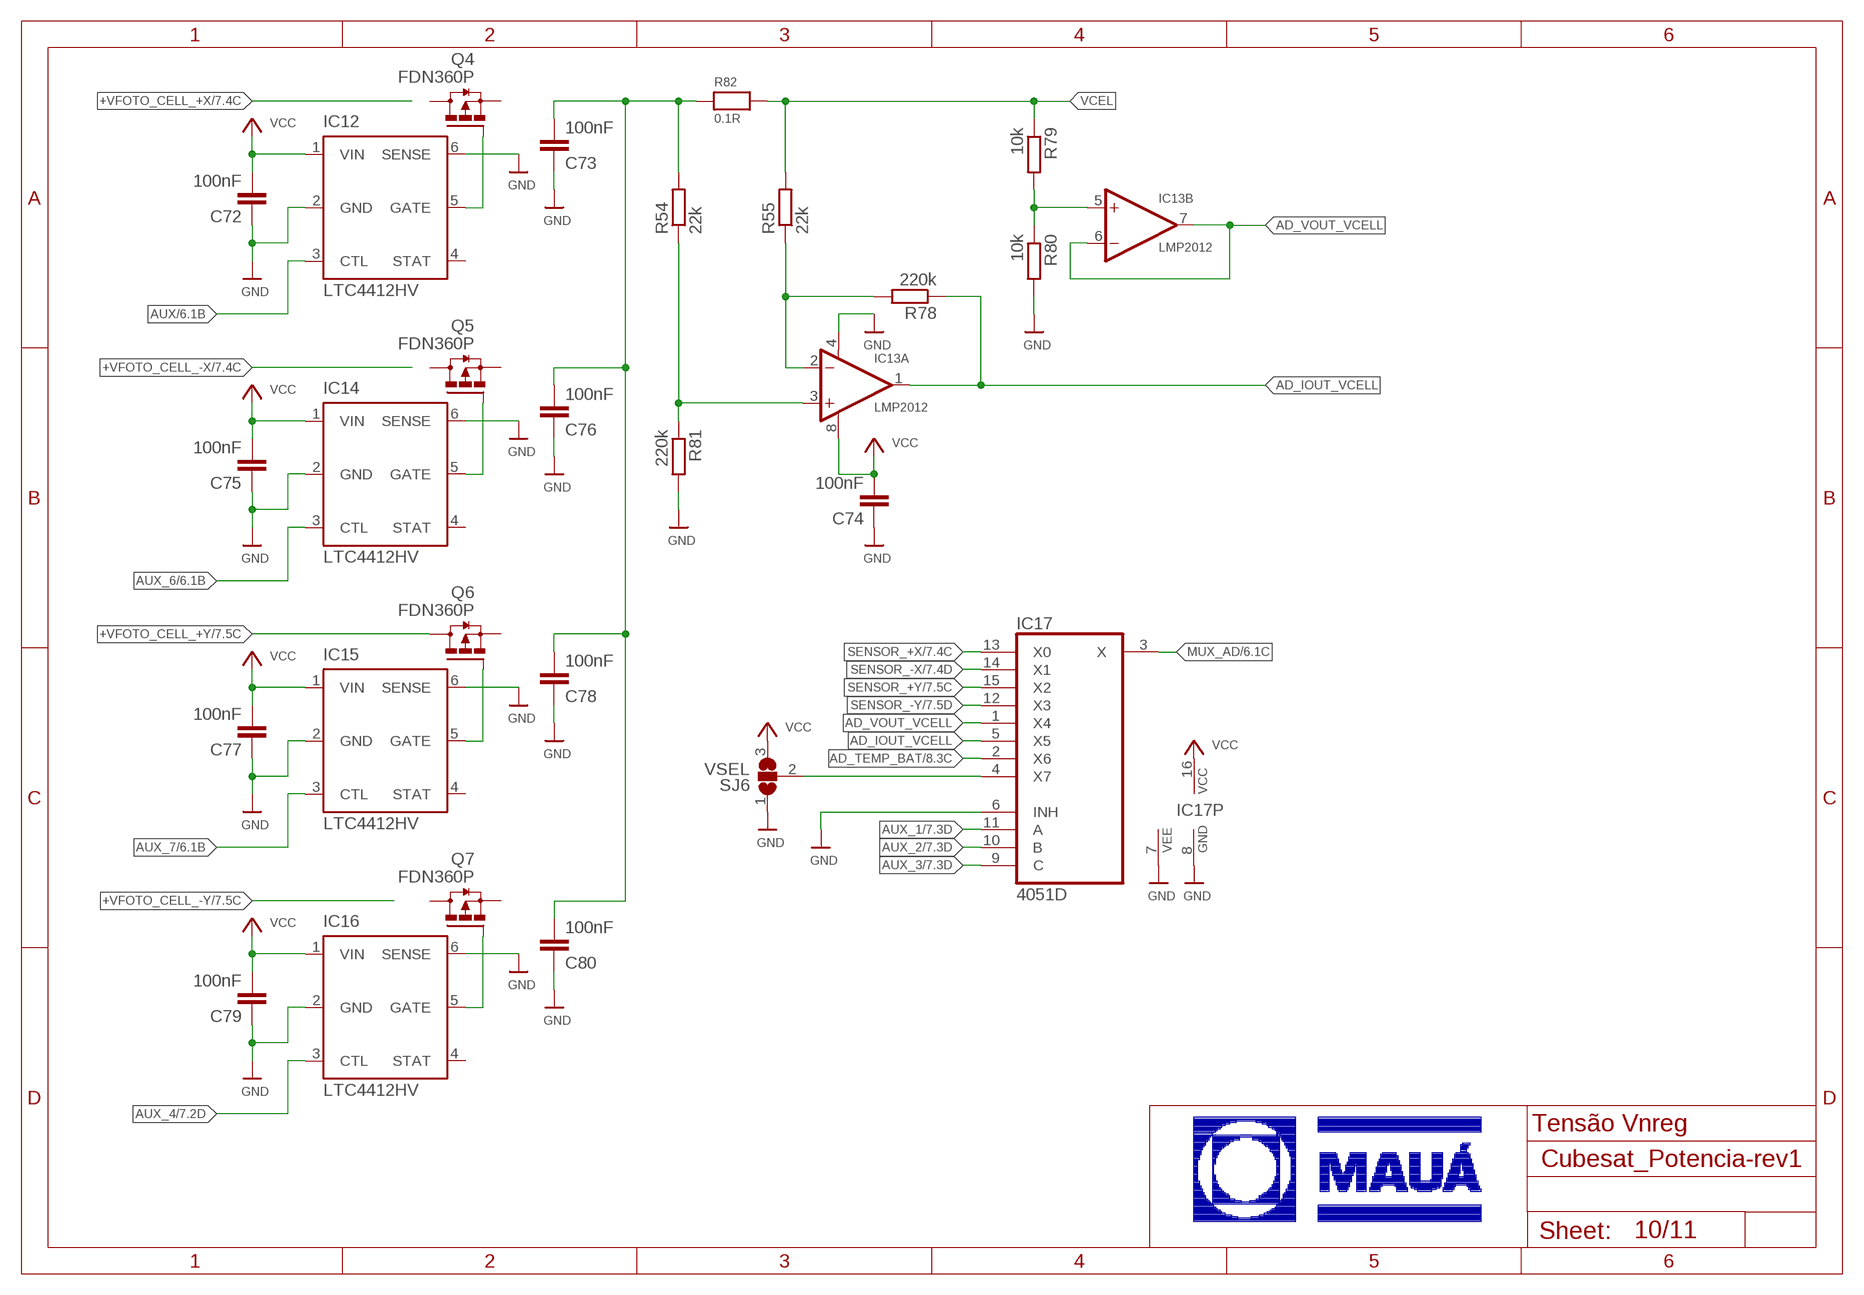
[diagram p9: schematic, sheet 10]

### Parts
C72  100nF  C-EUC0805  [C0805]
C73  100nF  C-EUC0805  [C0805]
C74  100nF  C-EUC0805  [C0805]
C75  100nF  C-EUC0805  [C0805]
C76  100nF  C-EUC0805  [C0805]
C77  100nF  C-EUC0805  [C0805]
C78  100nF  C-EUC0805  [C0805]
C79  100nF  C-EUC0805  [C0805]
C80  100nF  C-EUC0805  [C0805]
IC12  LTC4412HV  [TSOT23-6]
IC13  LMP2012  OPA2237E  [MSOP08]
IC14  LTC4412HV  [TSOT23-6]
IC15  LTC4412HV  [TSOT23-6]
IC16  LTC4412HV  [TSOT23-6]
IC17  4051D  [SO16]
Q4  FDN360P  [SUPER-SOT3]
Q5  FDN360P  [SUPER-SOT3]
Q6  FDN360P  [SUPER-SOT3]
Q7  FDN360P  [SUPER-SOT3]
R54  22k  R-EU_M0805  [M0805]
R55  22k  R-EU_M0805  [M0805]
R78  220k  R-EU_M0805  [M0805]
R79  10k  R-EU_M0805  [M0805]
R80  10k  R-EU_M0805  [M0805]
R81  220k  R-EU_M0805  [M0805]
R82  0.1R  RESISTOR2818  [_2818]
SJ6  VSEL  SJ2W  [SJ_2]

### Nets
+VFOTO_CELL_+Y: Q6.3(D) ; also sheet 7
AD_IOUT_VCELL: IC13.1(A:OUT) IC17.5(X5) R78.1
AD_TEMP_BAT: IC17.2(X6) ; also sheet 8
AD_VOUT_VCELL: IC13.6(B:-IN) IC13.7(B:OUT) IC17.1(X4)
AUX: IC12.3(CTL) ; also sheet 6,7
AUX_1: IC17.11(A) ; also sheet 7
AUX_2: IC17.10(B) ; also sheet 7
AUX_3: IC17.9(C) ; also sheet 7
AUX_4: IC16.3(CTL) ; also sheet 7
AUX_6: IC14.3(CTL) ; also sheet 6,7
AUX_7: IC15.3(CTL) ; also sheet 6,7
GND: C72.1 C73.1 C74.1 C75.1 C76.1 C77.1 C78.1 C79.1 C80.1 IC12.2(GND) IC12.6(SENSE) IC13.4(A:V-) IC14.2(GND) IC14.6(SENSE) IC15.2(GND) IC15.6(SENSE) IC16.2(GND) IC16.6(SENSE) IC17.6(INH) IC17.7(VEE) IC17.8(GND) R80.2 R81.2 SJ6.1 ; also sheet 1,2,3,4,5,6,7,8,9,11
MUX_AD: IC17.3(X) ; also sheet 6,7
N$74: IC12.5(GATE) Q4.1(G)
N$75: IC13.5(B:+IN) R79.2 R80.1
N$76: IC13.2(A:-IN) R55.1 R78.2
N$77: IC13.3(A:+IN) R54.1 R81.1
N$78: C73.2 C76.2 C78.2 C80.2 R54.2 R82.1
N$79: IC17.4(X7) SJ6.2
N$81: IC14.5(GATE) Q5.1(G)
N$82: IC15.5(GATE) Q6.1(G)
N$83: IC16.5(GATE) Q7.1(G)
SENSOR_+X: IC17.13(X0) ; also sheet 7
SENSOR_+Y: IC17.15(X2) ; also sheet 7
SENSOR_-X: IC17.14(X1) ; also sheet 7
SENSOR_-Y: IC17.12(X3) ; also sheet 7
VCC: C72.2 C74.2 C75.2 C77.2 C79.2 IC12.1(VIN) IC13.8(A:V+) IC14.1(VIN) IC15.1(VIN) IC16.1(VIN) IC17.16(VCC) SJ6.3 ; also sheet 1,2,3,4,5,6,7,8,11
VCEL: R55.2 R79.1 R82.2 ; also sheet 8
Unconnected: IC12.4(STAT) IC14.4(STAT) IC15.4(STAT) IC16.4(STAT) Q4.2(S) Q4.3(D) Q5.2(S) Q5.3(D) Q6.2(S) Q7.2(S) Q7.3(D)

### Notes on the sheet
- Tensão Vnreg

## Sheet 11 of 11: Painel Solar
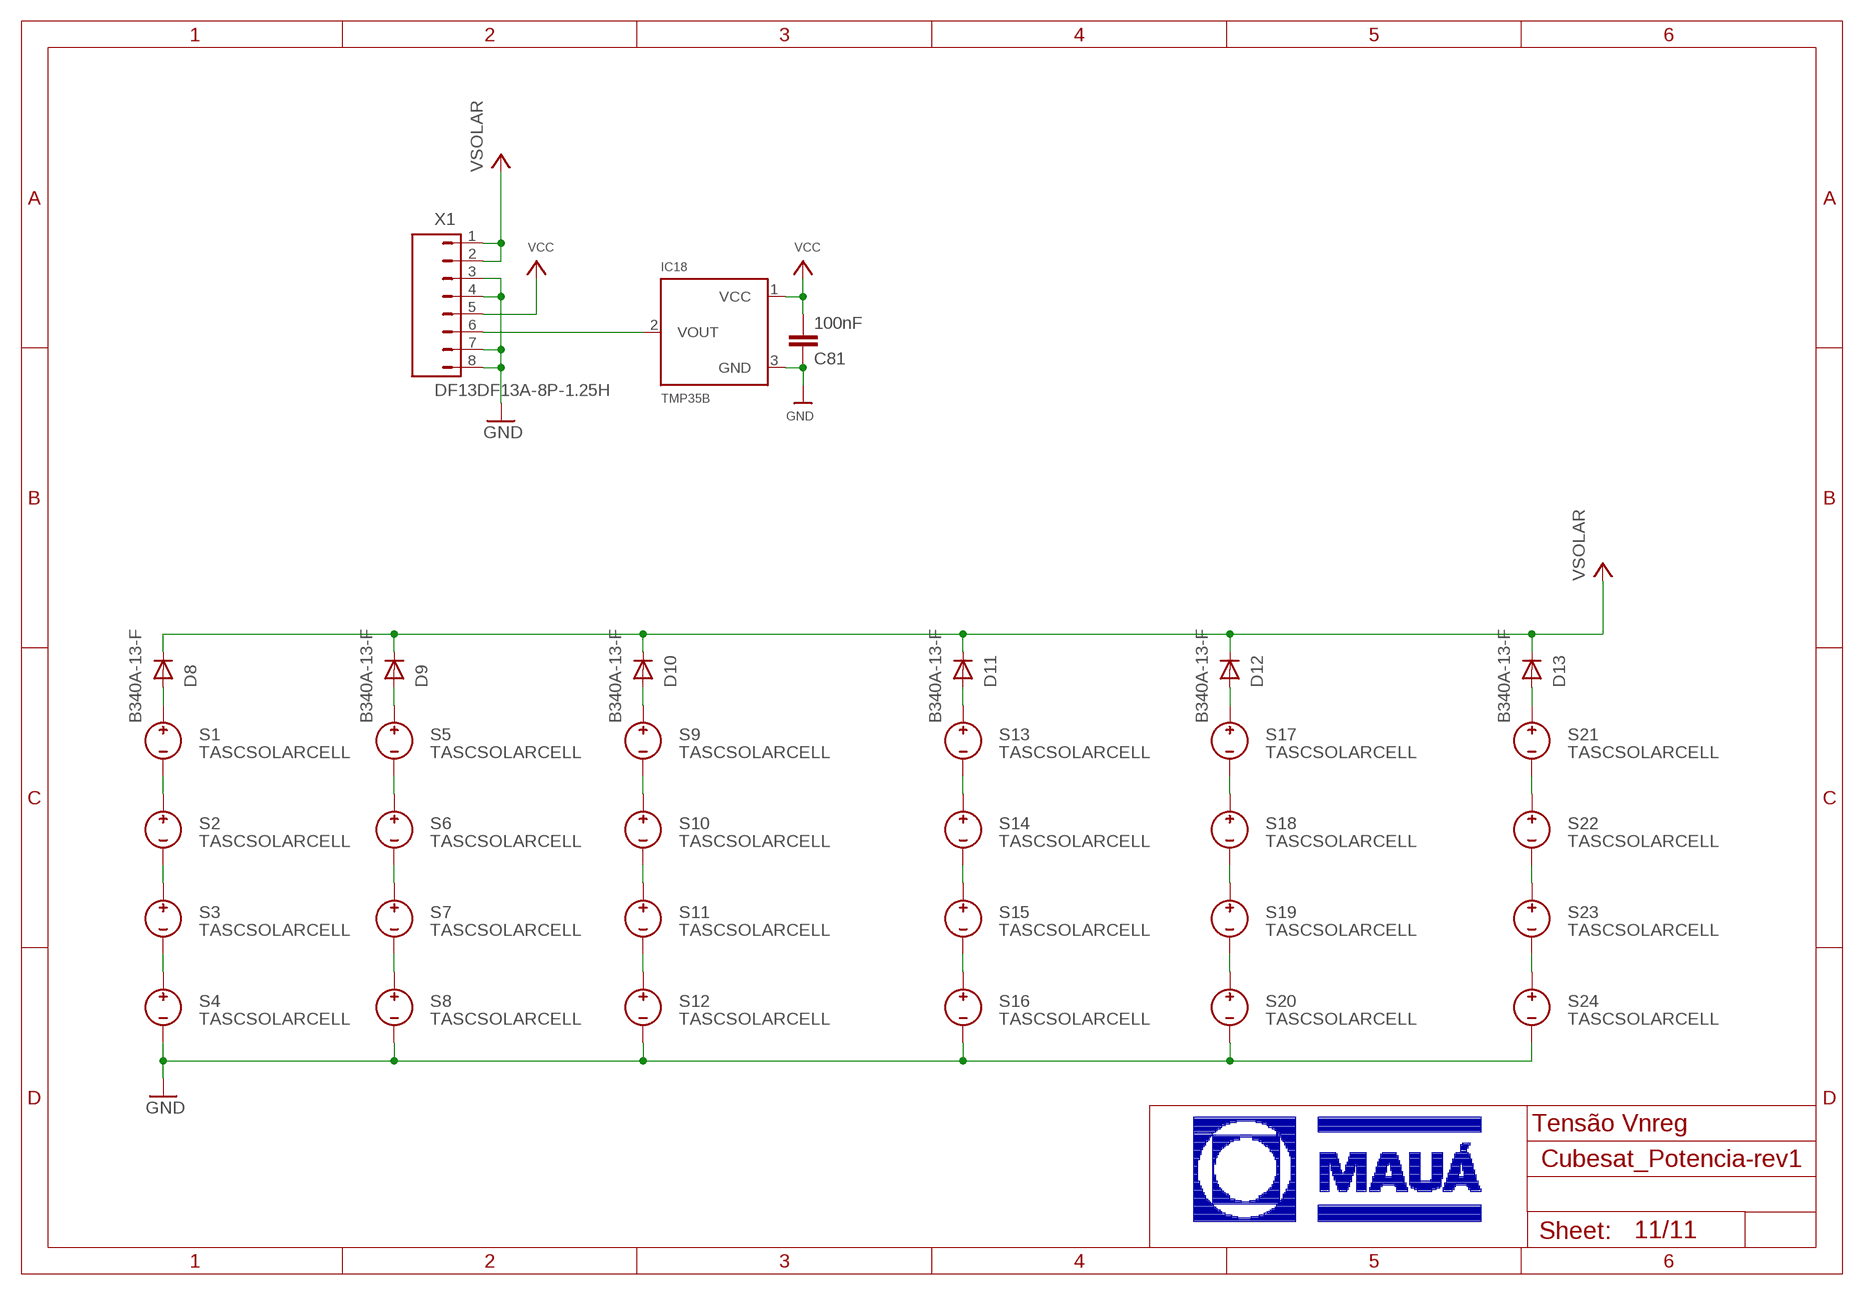
[diagram p10: schematic, sheet 11]

### Parts
C81  100nF  C-EUC0805  [C0805]
D8  B340A-13-F  DIODE-DO214AC  [DO214AC]
D9  B340A-13-F  DIODE-DO214AC  [DO214AC]
D10  B340A-13-F  DIODE-DO214AC  [DO214AC]
D11  B340A-13-F  DIODE-DO214AC  [DO214AC]
D12  B340A-13-F  DIODE-DO214AC  [DO214AC]
D13  B340A-13-F  DIODE-DO214AC  [DO214AC]
IC18  TMP35B  [TO92-LINE]
S1  TASCSOLARCELL  [TASCSOLARCELL]
S2  TASCSOLARCELL  [TASCSOLARCELL]
S3  TASCSOLARCELL  [TASCSOLARCELL]
S4  TASCSOLARCELL  [TASCSOLARCELL]
S5  TASCSOLARCELL  [TASCSOLARCELL]
S6  TASCSOLARCELL  [TASCSOLARCELL]
S7  TASCSOLARCELL  [TASCSOLARCELL]
S8  TASCSOLARCELL  [TASCSOLARCELL]
S9  TASCSOLARCELL  [TASCSOLARCELL]
S10  TASCSOLARCELL  [TASCSOLARCELL]
S11  TASCSOLARCELL  [TASCSOLARCELL]
S12  TASCSOLARCELL  [TASCSOLARCELL]
S13  TASCSOLARCELL  [TASCSOLARCELL]
S14  TASCSOLARCELL  [TASCSOLARCELL]
S15  TASCSOLARCELL  [TASCSOLARCELL]
S16  TASCSOLARCELL  [TASCSOLARCELL]
S17  TASCSOLARCELL  [TASCSOLARCELL]
S18  TASCSOLARCELL  [TASCSOLARCELL]
S19  TASCSOLARCELL  [TASCSOLARCELL]
S20  TASCSOLARCELL  [TASCSOLARCELL]
S21  TASCSOLARCELL  [TASCSOLARCELL]
S22  TASCSOLARCELL  [TASCSOLARCELL]
S23  TASCSOLARCELL  [TASCSOLARCELL]
S24  TASCSOLARCELL  [TASCSOLARCELL]
X1  DF13DF13A-8P-1.25H  [DF13A-8P]

### Nets
GND: C81.1 IC18.3(GND) S4.N S8.N S12.N S16.N S20.N S24.N X1.3 X1.4 X1.7 X1.8 ; also sheet 1,2,3,4,5,6,7,8,9,10
N$89: S1.N S2.P
N$90: S2.N S3.P
N$91: S3.N S4.P
N$92: S5.N S6.P
N$93: S6.N S7.P
N$94: S7.N S8.P
N$95: S9.N S10.P
N$96: S10.N S11.P
N$97: S11.N S12.P
N$98: S13.N S14.P
N$99: S14.N S15.P
N$100: S15.N S16.P
N$101: S17.N S18.P
N$102: S18.N S19.P
N$103: S19.N S20.P
N$104: S21.N S22.P
N$105: S22.N S23.P
N$106: S23.N S24.P
N$107: D8.A S1.P
N$108: IC18.2(VOUT) X1.6
N$109: D9.A S5.P
N$110: D10.A S9.P
N$111: D11.A S13.P
N$112: D12.A S17.P
N$113: D13.A S21.P
VCC: C81.2 IC18.1(VCC) X1.5 ; also sheet 1,2,3,4,5,6,7,8,10
VSOLAR: D8.C D9.C D10.C D11.C D12.C D13.C X1.1 X1.2

### Notes on the sheet
- Tensão Vnreg

## Library data of the parts
+X +Y -X -Y = pinhead:PINHD-1X5: PIN HEADER
BACKUP = junior:HEADER-2X13
BACKUP1 = pinhead:PINHD-2X16: PIN HEADER
BAT FOTOCELULA JP2 = junior:HEADER-1X2: PIN HEADER
C1-C4 C6 C8 C13-C21 C23-C28 C31-C46 C49-C51 C53 C55 C58-C81 = rcl:C-EU: CAPACITOR, European symbol
C5 C7 C9-C12 C22 C29 C30 C47 C48 C52 C54 C56 C57 = junior:CAP_TANTALUM: Tantalum Capacitors Wave footprints have larger pads and are meant to be used for hand soldering. Reflow footprints are optimised for solder paste and a reflow oven. EIA3216-18/A-[R/W] - Size A / 3216-18 / 1206 footprint 4.7µF 25V 10% Tantalum Capacitor 10µF 16V 10% Tantalum Capacitor [Digikey: 495-2236-2-ND] EIA3528-21/B-[R/W] - Size B / 3528-21 47µF 10V 10% Tantalum Capactior [Digikey: 495-2216-1-ND] EIA6032-28/C-[R/W] - Size C / 6032-28 10µF 35V 20% Tantalum Capacitor [Digikey: 495-2285-1-ND] 100µF 16V 10% Tantalum Capactior [Digikey: 399-5214-1-ND]
CAN SERIAL = dp_devices:CON_HEADER_1X04
D1-D13 = diode:DIODE-: DIODE
DEBUG = dp_devices:CON_HEADER_2X03
IC1-IC4 IC12 IC14-IC16 = linear-technology:LTC4412HV
IC5-IC8 IC13 = burr-brown:OPA2237: Single-Supply Operational Amplifiers MicroAmplifier(TM) Series; Product Folder:OPA2237; MF: TEXAS INSTRUMENTS; MPN: OPA2237EA/250; OC_FARNELL: 1470365; OC_NEWARK: 35C1853
IC9 = microchip:PIC18F66K80: PIC18F66K80 FAMILY 28/40/44/64-Pin, Enhanced Flash Microcontrollers with ECAN™ and nanoWatt XLP Technology
IC10 IC18 = junior:TMP35
IC11 = microchip:MCP2551
IC17 = 40xx:4051: 8-channel ANALOG MULTIPLEXER
ICSP = dp_devices:CON_HEADER_PRG_PIC_ICSP: 5-pin PIC In Circuit Serial Programming header
L1 = lbr_tcc2:SDR1307-330KL; DCR: 0.065; IDC: 3.1; L: 3.3E-5; MANUFACTURER_NAME: Bourns; MANUFACTURER_PART_NUMBER: SDR1307-330KL; VENDOR: Bourns
L2-L7 = lbr_tcc:SRR6038-3R3Y; DCR: 0.02; IDC: 3.5; L: 3.3E-6; MANUFACTURER_NAME: Bourns; MANUFACTURER_PART_NUMBER: SRR6038-3R3Y; VENDOR: Bourns
LED1-LED5 = junior:LED: LED 0603 - 0603 Surface Mount Package 2mA: Green LED - Low Power (3.9mcd, 2ma, 1.7Vf) - Digikey: 475-2709-2-ND Orange LED - Low Power (9.8mcd, 2ma, 1.8Vf) - Digikey: 475-1194-2-ND Red LED - Low Power (5mcd, 2ma, 1.8Vf) - Digikey: 475-1195-2-ND Yellow LED - Low Power (7mcd, 2ma, 1.8Vf) - Digikey: 475-1196-2-ND 5mA: Blue LED - Low Power (17mcd, 5ma, 2.9Vf) - Digikey: LNJ937W8CRACT-ND 0805 - 0805 Surface Mount Package 2mA: Red LED (8.8mcd, 2mA, 1.8Vf, Clear) - Low Power [Digikey: 475-2510-1-ND] Green LED (5mcd, 2mA, 1.8Vf, Clear) - Low Power [Digikey: 475-2730-1-ND] Yellow LED (11.3mcd, 2mA, 1.8Vf, Clear) - Low Power [Digikey: 475-2555-1-ND] 20mA: Red LED (104mcd, 20mA, Diffused) - LS R976 [Digikey: 475-1278-6-ND] Red LED (12mcd, 20mA, 2.0Vf, Clear) - APT2012EC [Digikey: 754-1128-1-ND] Green LED (15mcd, 20mA, 2.2Vf, Clear) - APT2012GC [Digikey: 754-1131-1-ND] Orange LED (160mcd, 20mA, 2.1Vf, Clear) - APT2012SECK [Digikey: 754-1130-1-ND] 1206 - 1206 Surface Mount Package Green LED (26mcd, 20mA, Diffused) - LG N971 [Digikey: 475-1407-6-ND] Red LED (15mcd, 20mA, Diffused) - LH N974 [Digikey: 475-1416-6-ND]
Q1 = lbr_tcc2:CSD16323Q3; DATASHEETURL: http://focus.ti.com/lit/ds/symlink/csd16323q3.pdf; IDSMAX: 60.0; MANUFACTURER_NAME: Texas Instruments; MANUFACTURER_PART_NUMBER: CSD16323Q3; QGTYP: 6.2; QUANTITY: 1; RDSON45: 0.0044; VDSMAX: 25.0; VENDOR: Texas Instruments
Q2 Q4-Q7 = transistor-power:FDN360P: Single P-Channel, PowerTrench (R) MOSFET Source: http://www.fairchildsemi.com/ds/FD/FDN360P.pdf
Q3 = crystal:CRYSTAL: CRYSTAL; OC_FARNELL: 1667008; OC_NEWARK: unknown
R1-R26 R28-R31 R33-R37 R39-R43 R46-R81 R83-R86 = rcl:R-EU_: RESISTOR, European symbol
R27 R32 R38 R44 R45 R82 = junior:RESISTOR: Resistors 0402 - 0402 Surface Mount Package 22 Ohm 1% 1/16W [Digikey: 311-22.0LRTR-ND] 33 Ohm 5% 1/16W 1.0K 5% 1/16W 1.5K 5% 1/16W 2.0K 1% 1/16W 10.0K 1% 1/16W [Digikey: 311-10.0KLRTR-ND] 10.0K 5% 1/16W [Digikey: RMCF0402JT10K0TR-ND] 12.1K 1% 1/16W [Digikey: 311-22.0LRTR-ND] 100.0K 5% 1/16W 0603 - 0603 Surface Mount Package 0 Ohm 1/10 Watt 1% Resistor 15 Ohm 1/10 Watt 1% Resistor 33 Ohm 1/10 Watt 1% Resistor 49.9 Ohm 1/10 Watt 1% Resistor 100 Ohm 1/10 Watt 1% Resistor 150 Ohm 1/10 Watt 1% Resistor 240 Ohm 1/10 Watt 1% Resistor 390 Ohm 1/10 Watt 1% Resistor 560 Ohm 1/10 Watt 1% Resistor 680 Ohm 1/10 Watt 1% Resistor 750 Ohm 1/10 Watt 1% Resistor 1.0K Ohm 1/10 Watt 1% Resistor 1.5K Ohm 1/10 Watt 1% Resistor 2.0K Ohm 1/10 Watt 1% Resistor 2.2K Ohm 1/10 Watt 1% Resistor 3.3K Ohm 1/10 Watt 1% Resistor 4.7K Ohm 1/10 Watt 1% Resistor 10.0K Ohm 1/10 Watt 1% Resistor 12.0K Ohm 1/10 Watt 1% Resistor 12.1K Ohm 1/10 Watt 1% Resistor 20.0K Ohm 1/10 Watt 1% Resistor 33.0K Ohm 1/10 Watt 1% Resistor 100.0K Ohm 1/10 Watt 1% Resistor 0805 - 0805 Surface Mount Package 0 Ohm 1/8 Watt 1% Resistor 33 Ohm 1/8 Watt 1% Resistor 100 Ohm 1/8 Watt 1% Resistor 150 Ohm 1/8 Watt 1% Resistor 200 Ohm 1/8 Watt 1% Resistor 240 Ohm 1/8 Watt 1% Resistor 330 Ohm 1/8 Watt 1% Resistor 390 Ohm 1/8 Watt 1% Resistor 470 Ohm 1/8 Watt 1% Resistor 1.0K Ohm 1/8 Watt 1% Resistor 1.5K Ohm 1/8 Watt 1% Resistor 2.0K Ohm 1/8 Watt 1% Resistor 4.7K Ohm 1/8 Watt 1% Resistor 5.1K Ohm 1/8 Watt 1% Resistor 5.6K Ohm 1/8 Watt 1% Resistor 10.0K Ohm 1/8 Watt 1% Resistor 22.0K Ohm 1/8 Watt 1% Resistor 33.0K Ohm 1/8 Watt 1% Resistor 100K Ohm 1/8 Watt 1% Resistor 1206 - 1206 Surface Mount Package 2012 - 2010 Surface Mount Package 0.11 Ohm 1/2 Watt 1% Resistor - Digikey: RHM.11UCT-ND
S1-S24 = OSSI:TASCSOLARCELL
SJ1 SJ2 SJ6 = jumper:SJ2W: SMD solder JUMPER
SJ3-SJ5 SJ7 = junior:SOLDERJUMPER: SMD Solder JUMPER Solder the two pads together to create a connection, or remove the solder to break it. REFLOW - Use this footprint for solder paste and reflow ovens. WAVE - Use this footprint for hand-soldering (larger pads). CLOSED - Has a trace between the two pads to ensure it is closed by default. The trace needs to be cut to disable the jumper, and can be closed again by creating a solder bridge between the two pads.; BOM: EXCLUDE
T1-T6 = zetex:PMOS2: DUAL 30V P-CHANNEL ENHANCEMENT MODE MOSFET Source: Data sheet <http://www.diodes.com/datasheets/ZXMP3A16DN8.pdf> SOP8 Source: Data sheet <http://www.diodes.com/datasheets/ZXMD63P03X.pdf> MSOP8; OC_FARNELL: unknown; OC_NEWARK: unknown
TP1-TP11 = junior:TESTPOINT: Test Point Various test points for characterisation and PCB testing TESTPOINT_SMT - Compact Surface Mount Test Point [Digikey: 5016KTR-ND]; BOM: EXCLUDE
U1 U2 U4 = lbr_tcc:TPS563200DDCR; ADDRESS1: Not shown in title block; ADDRESS2: Not shown in title block; ADDRESS3: Not shown in title block; ADDRESS4: Not shown in title block; ALTERNATEMANUFACTURER: None; APPROVEDBY: Not shown in title block; AUTHOR: Not shown in title block; CHECKEDBY: Not shown in title block; COMPANYNAME: Not shown in title block; COMPONENTLINK1DESCRIPTION: Datasheet Link; COMPONENTLINK1URL: https://sps06.itg.ti.com/sites/KMS/crossdivteams/altium/docs/ComponentDatasheets/TPS56320xDDC_Users_Guide_v0p1_14_0203.pdf; COMPTYPE: IC; CURRENTDATE: Not shown in title block; CURRENTTIME: Not shown in title block; DATE: Not shown in title block; DESIGNATOR: U?; DOCUMENTFULLPATHANDNAME: Not shown in title block; DOCUMENTNAME: Not shown in title block; DOCUMENTNUMBER: 1; ENGINEER: Not shown in title block; IMAGEPATH: Not shown in title block; LATESTREVISIONDATE: 2014-04-14; MANUFACTURER: Texas Instruments; MANUFACTURER_NAME: Texas Instruments; MANUFACTURER_PART_NUMBER: TPS563200DDCR; MODIFIEDDATE: Not shown in title block; MOUNTTYPE: SMT; ORGANIZATION: Not shown in title block; PACKAGEREFERENCE: DDC0006A; PARTNUMBER: TPS563200DDC; PIN_COUNT: 6; PROJECTNAME: *; PUBLISHER: Texas Instruments; REVISION: Use project parameter SCH_Rev; ROHS: Y; RULE: *; SHEETNUMBER: 1; SHEETTOTAL: 1; SYMBOLCREATOR: a0411947; SYMBOLVERSION: 2014-04-11; TIME: Not shown in title block
U3 = BQ24005:BQ24005_PWP_20
U5 = LTC_By_element14_Batch_1:LT1941EFEPBF: Switching Regulator; MPN: LT1941EFE#PBF; OC_FARNELL: 1273793; OC_NEWARK: 58M1020; PACKAGE: TSSOP-28; SUPPLIER: Linear Technology
U6 = lbr_tcc2:LM3488MM/NOPB; DATASHEETURL: http://www.ti.com/product/lm3488; FREQUENCY: 1000000.0; IMAX: 20.0; MANUFACTURER_NAME: Texas Instruments; MANUFACTURER_PART_NUMBER: LM3488MM/NOPB; MKTG_PACKAGE: NA; NSID: LM3488MM/NOPB; PACKAGE: NA; VENDOR: Texas Instruments
V_BUS = pinhead:PINHD-2X20: PIN HEADER
X1 = OSSI:DF13: Hirose DF13 series connector